# EasyEDA schematic SCH_DV_MR_rev_modbus_18.16_2022-01-16.json

## Sheets
1 DV_MR_rev_18.16_modbus_ADC_555 COILER TIMERS: TITLE: IGNITION CIRCUIT 555; REV: 18.15; Date: 2021-10-15; Sheet: 3/6; Drawn By: David Marshall
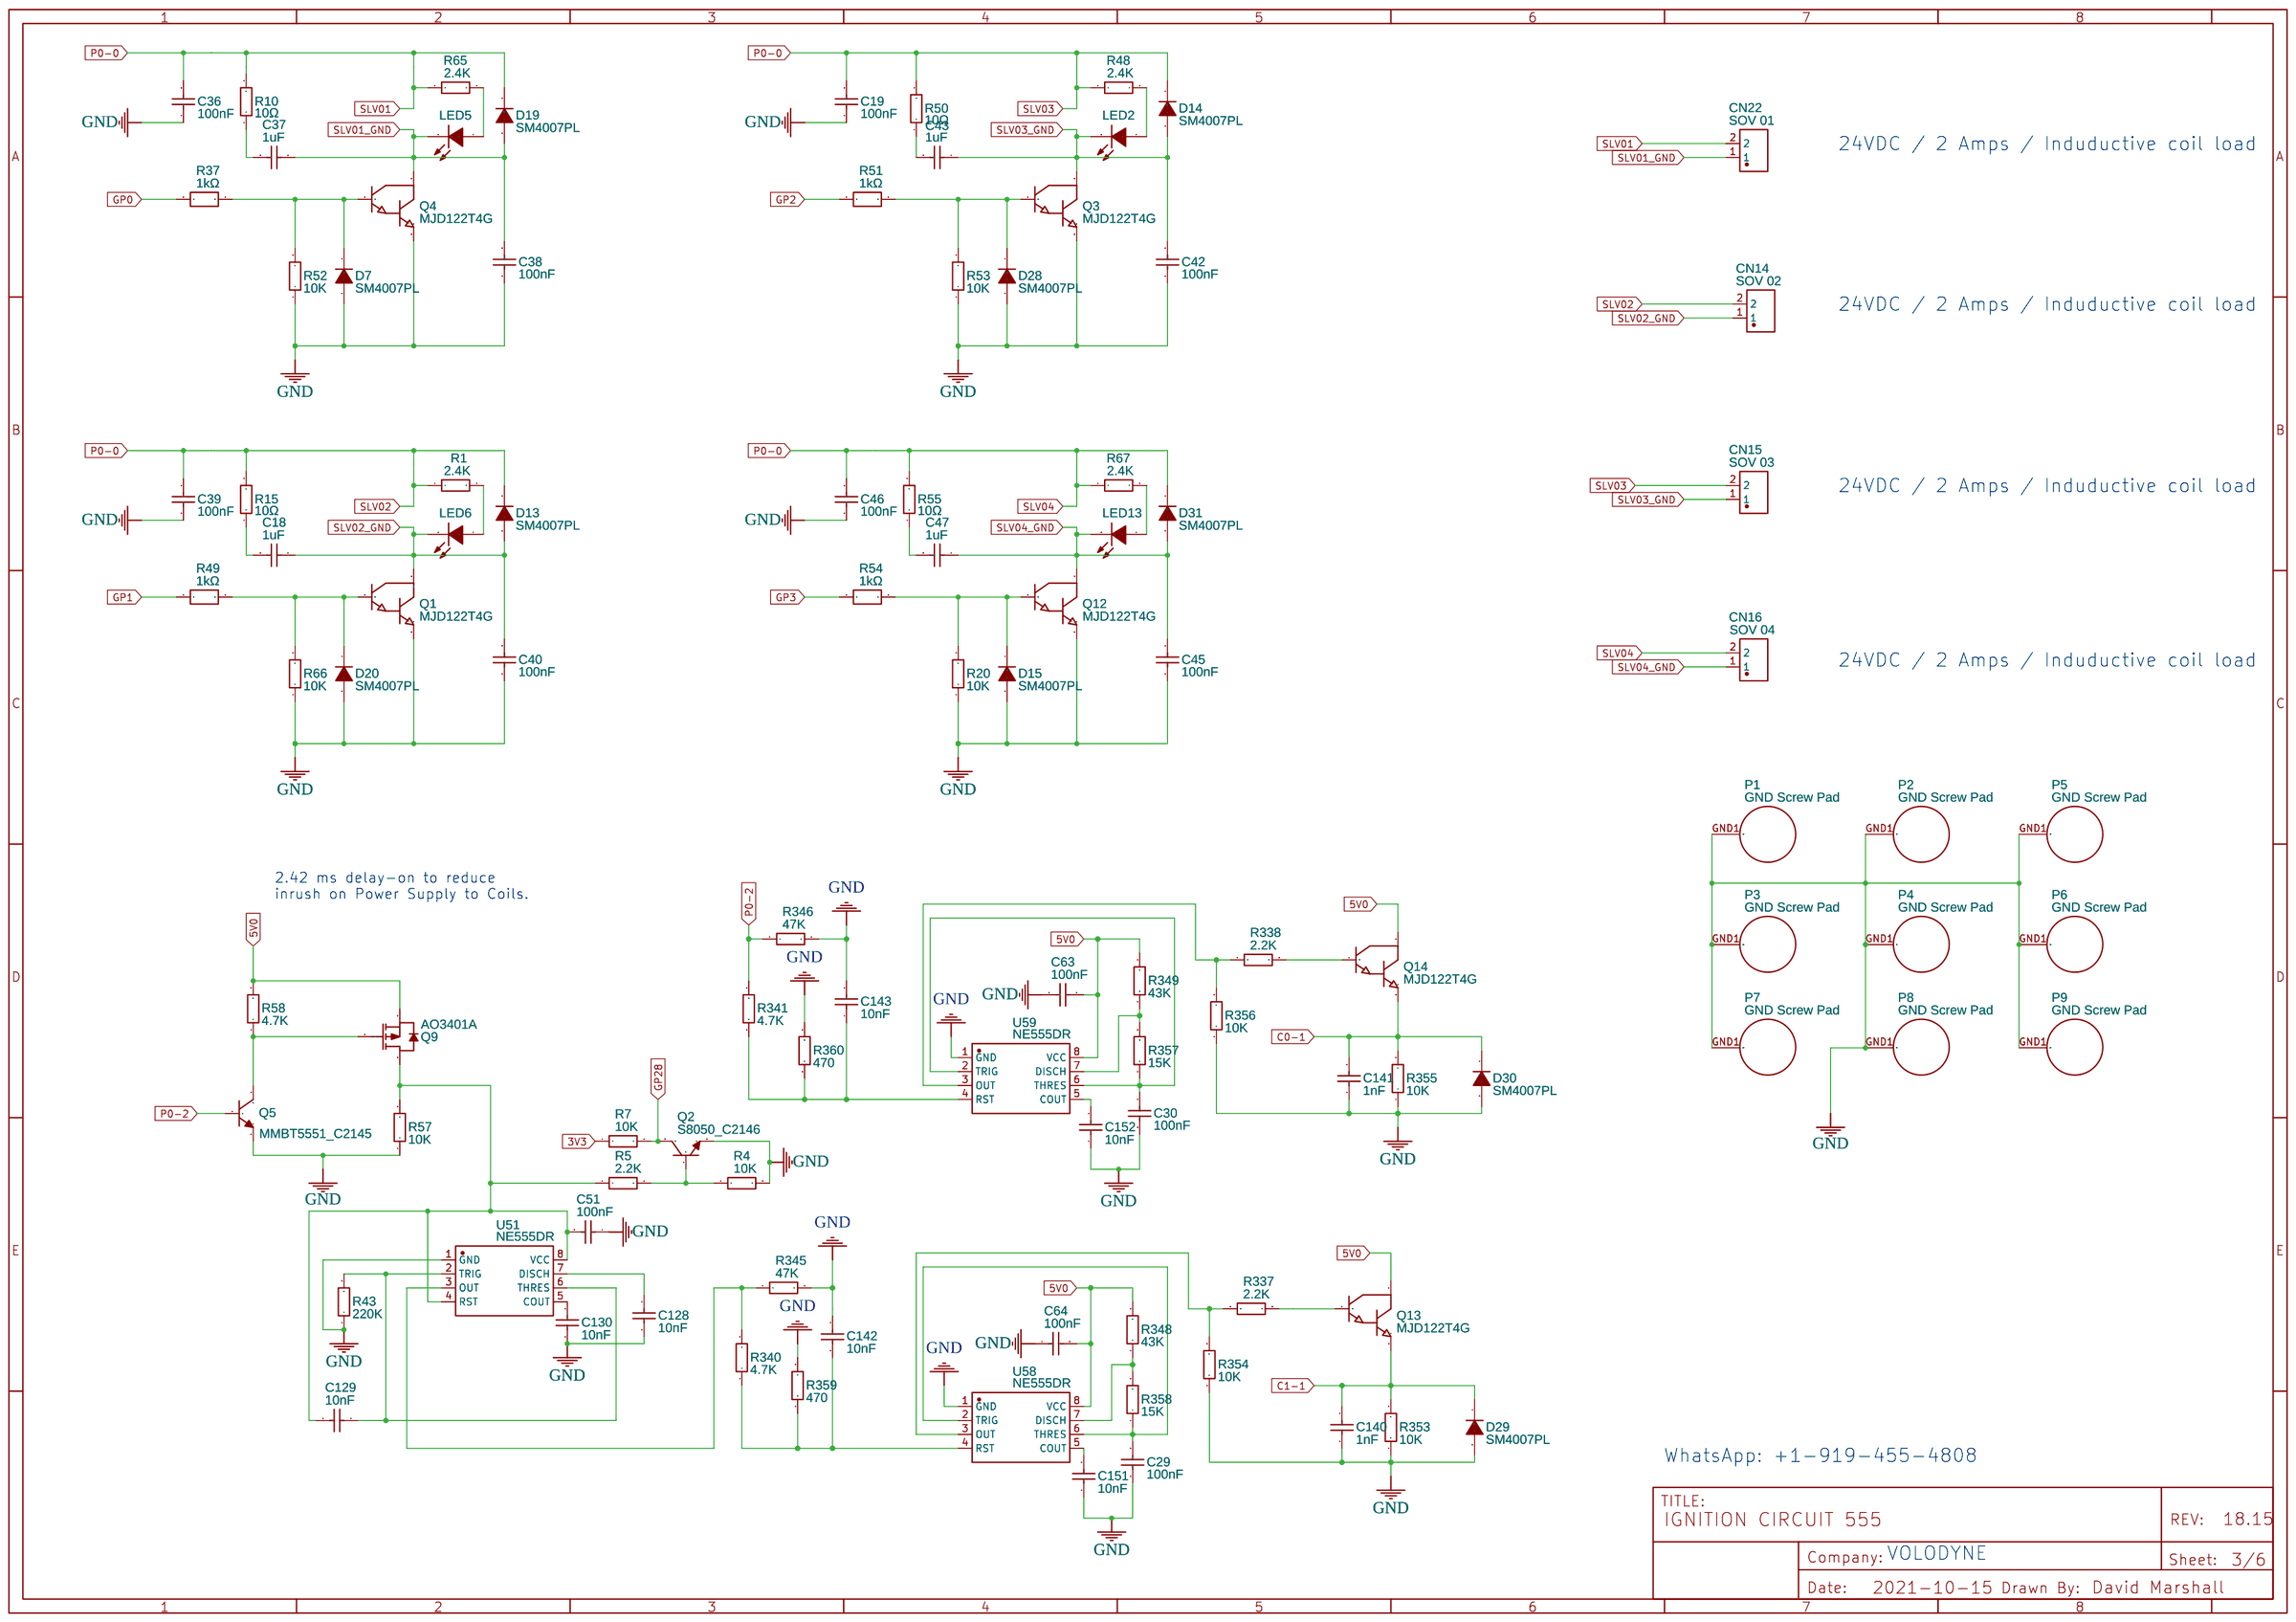
[diagram p0: DV_MR_rev_18.16_modbus_ADC_555 COILER TIMERS]
2 DV_MR_rev_18.16_modbus_ADC_PICO PI MCU: TITLE: MICRO PROCESSOR I2C - MODBUS TCP; Sheet: 5/6
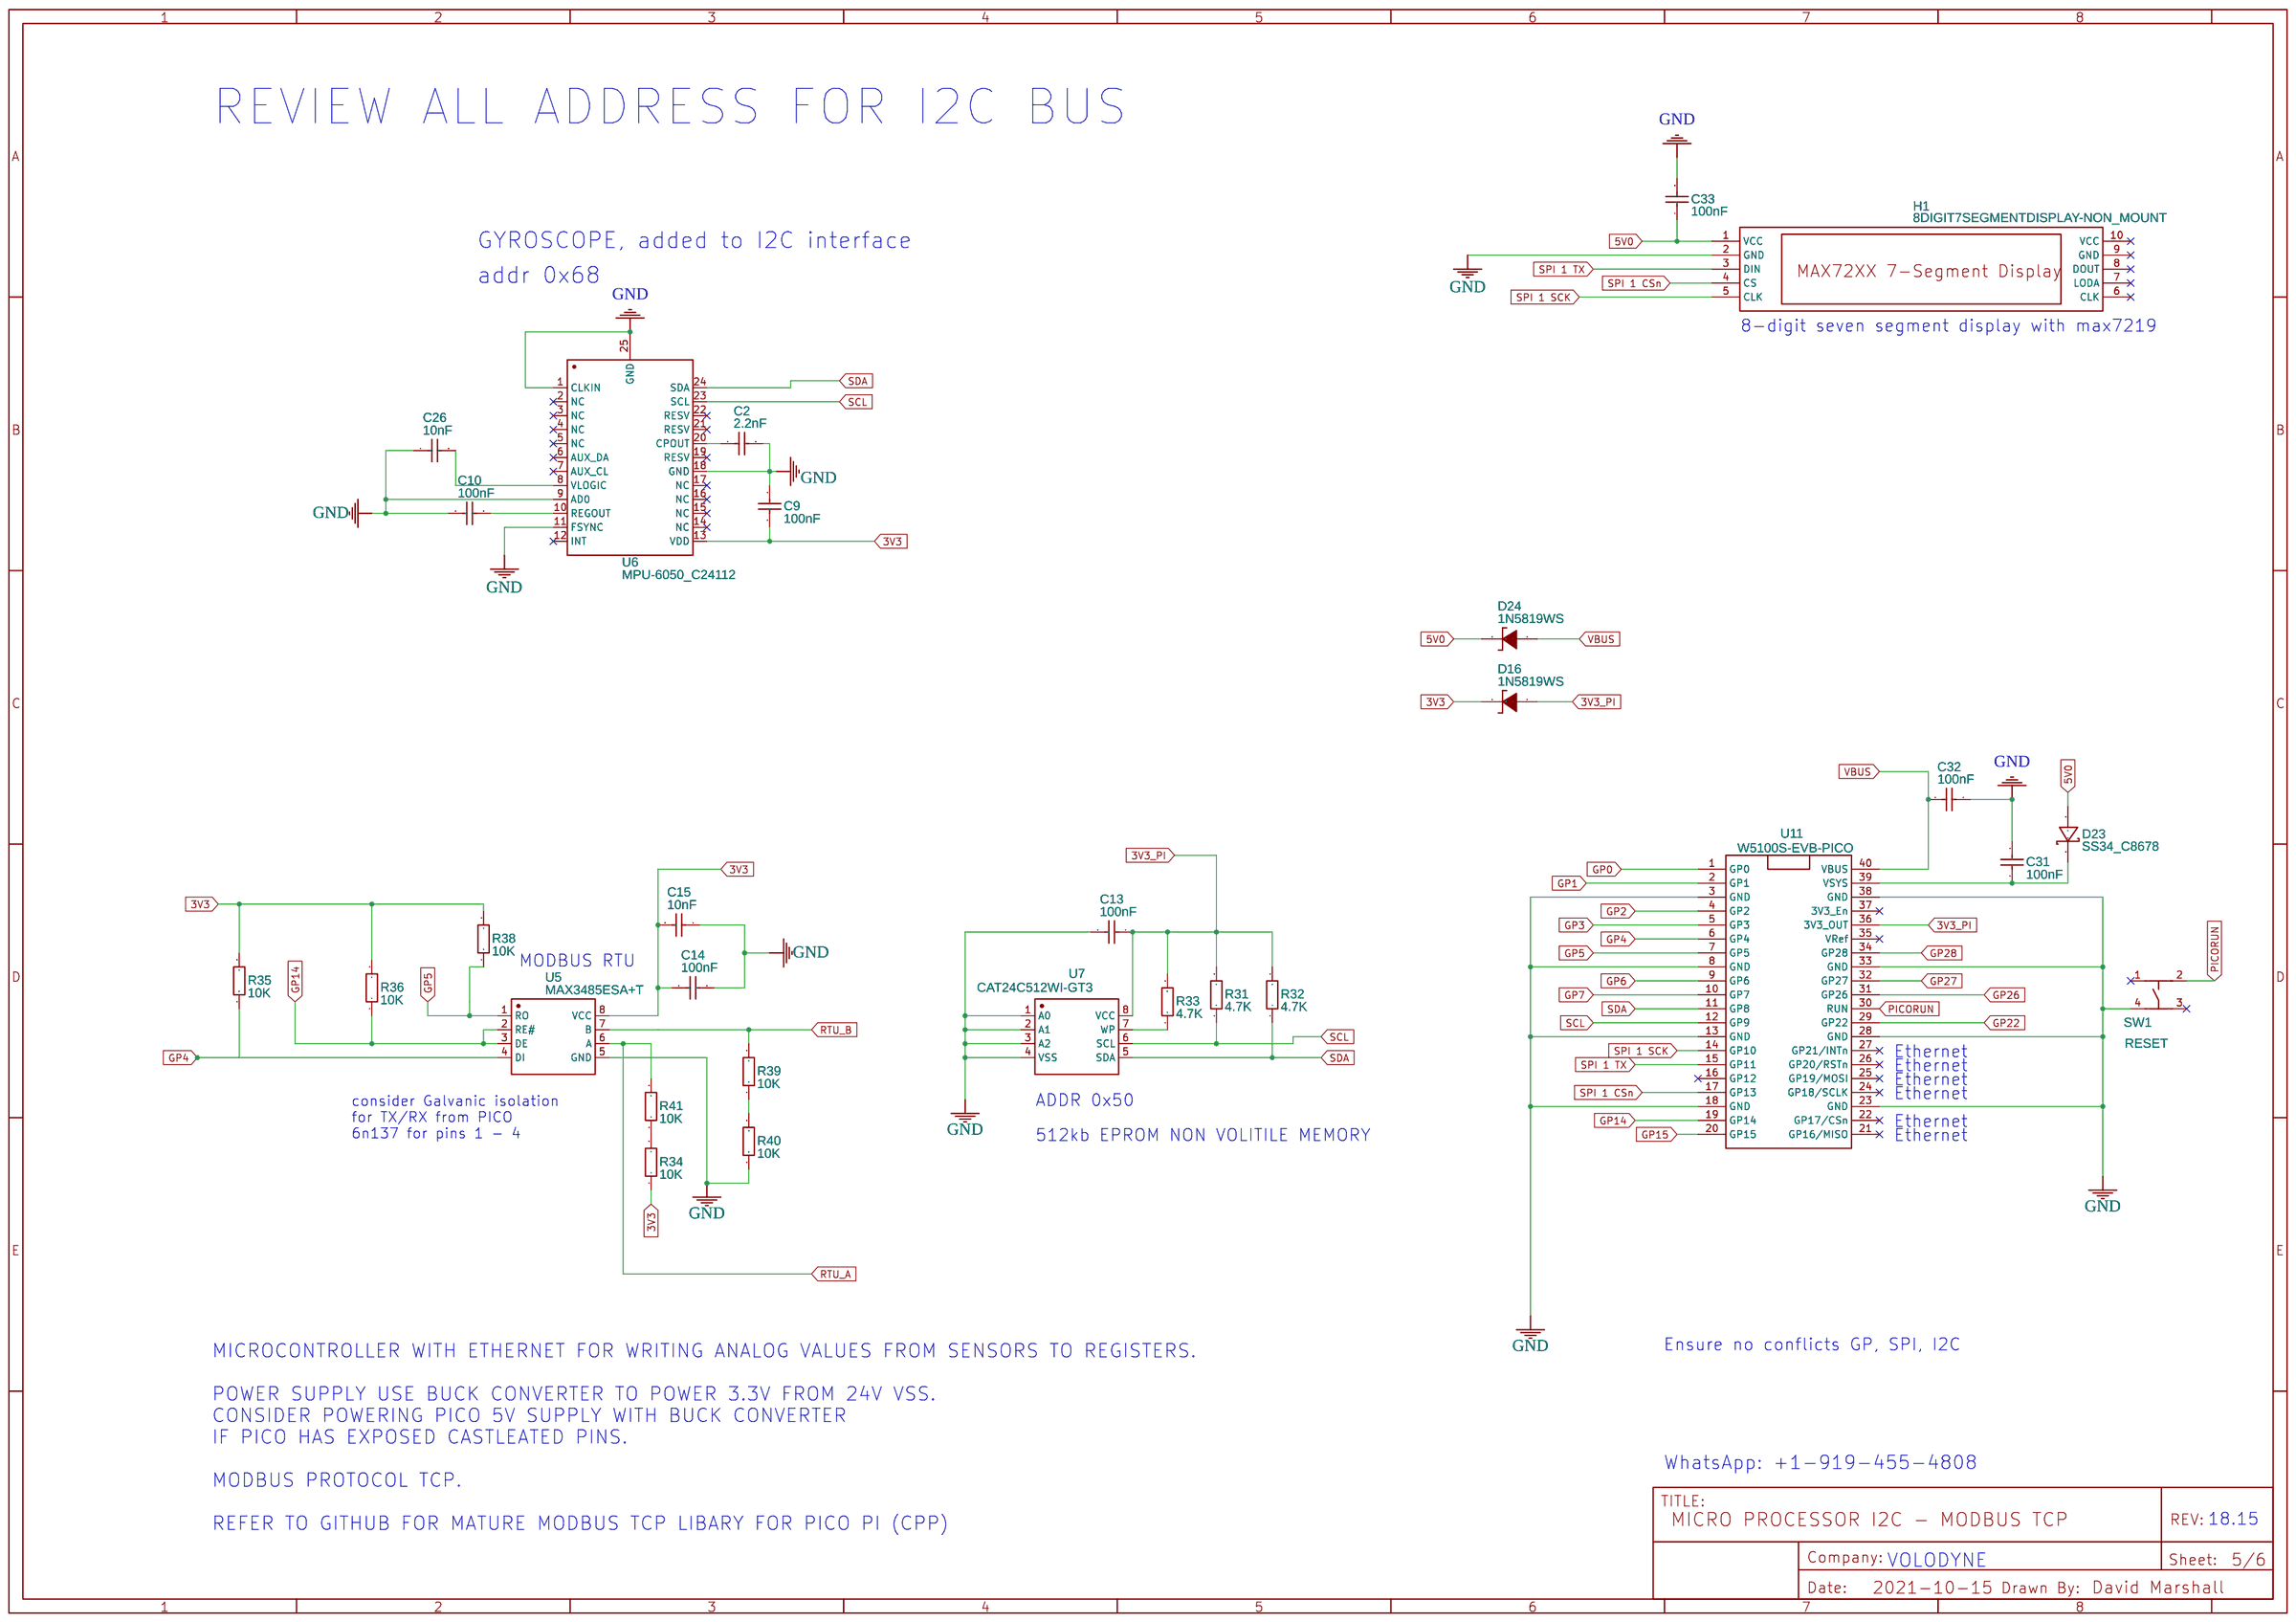
[diagram p1: DV_MR_rev_18.16_modbus_ADC_PICO PI MCU]
3 DV_MR_rev_18.16_modbus_ADC_CURRENT SENSORS: TITLE: CURRENT SENSORS; Sheet: 6/6
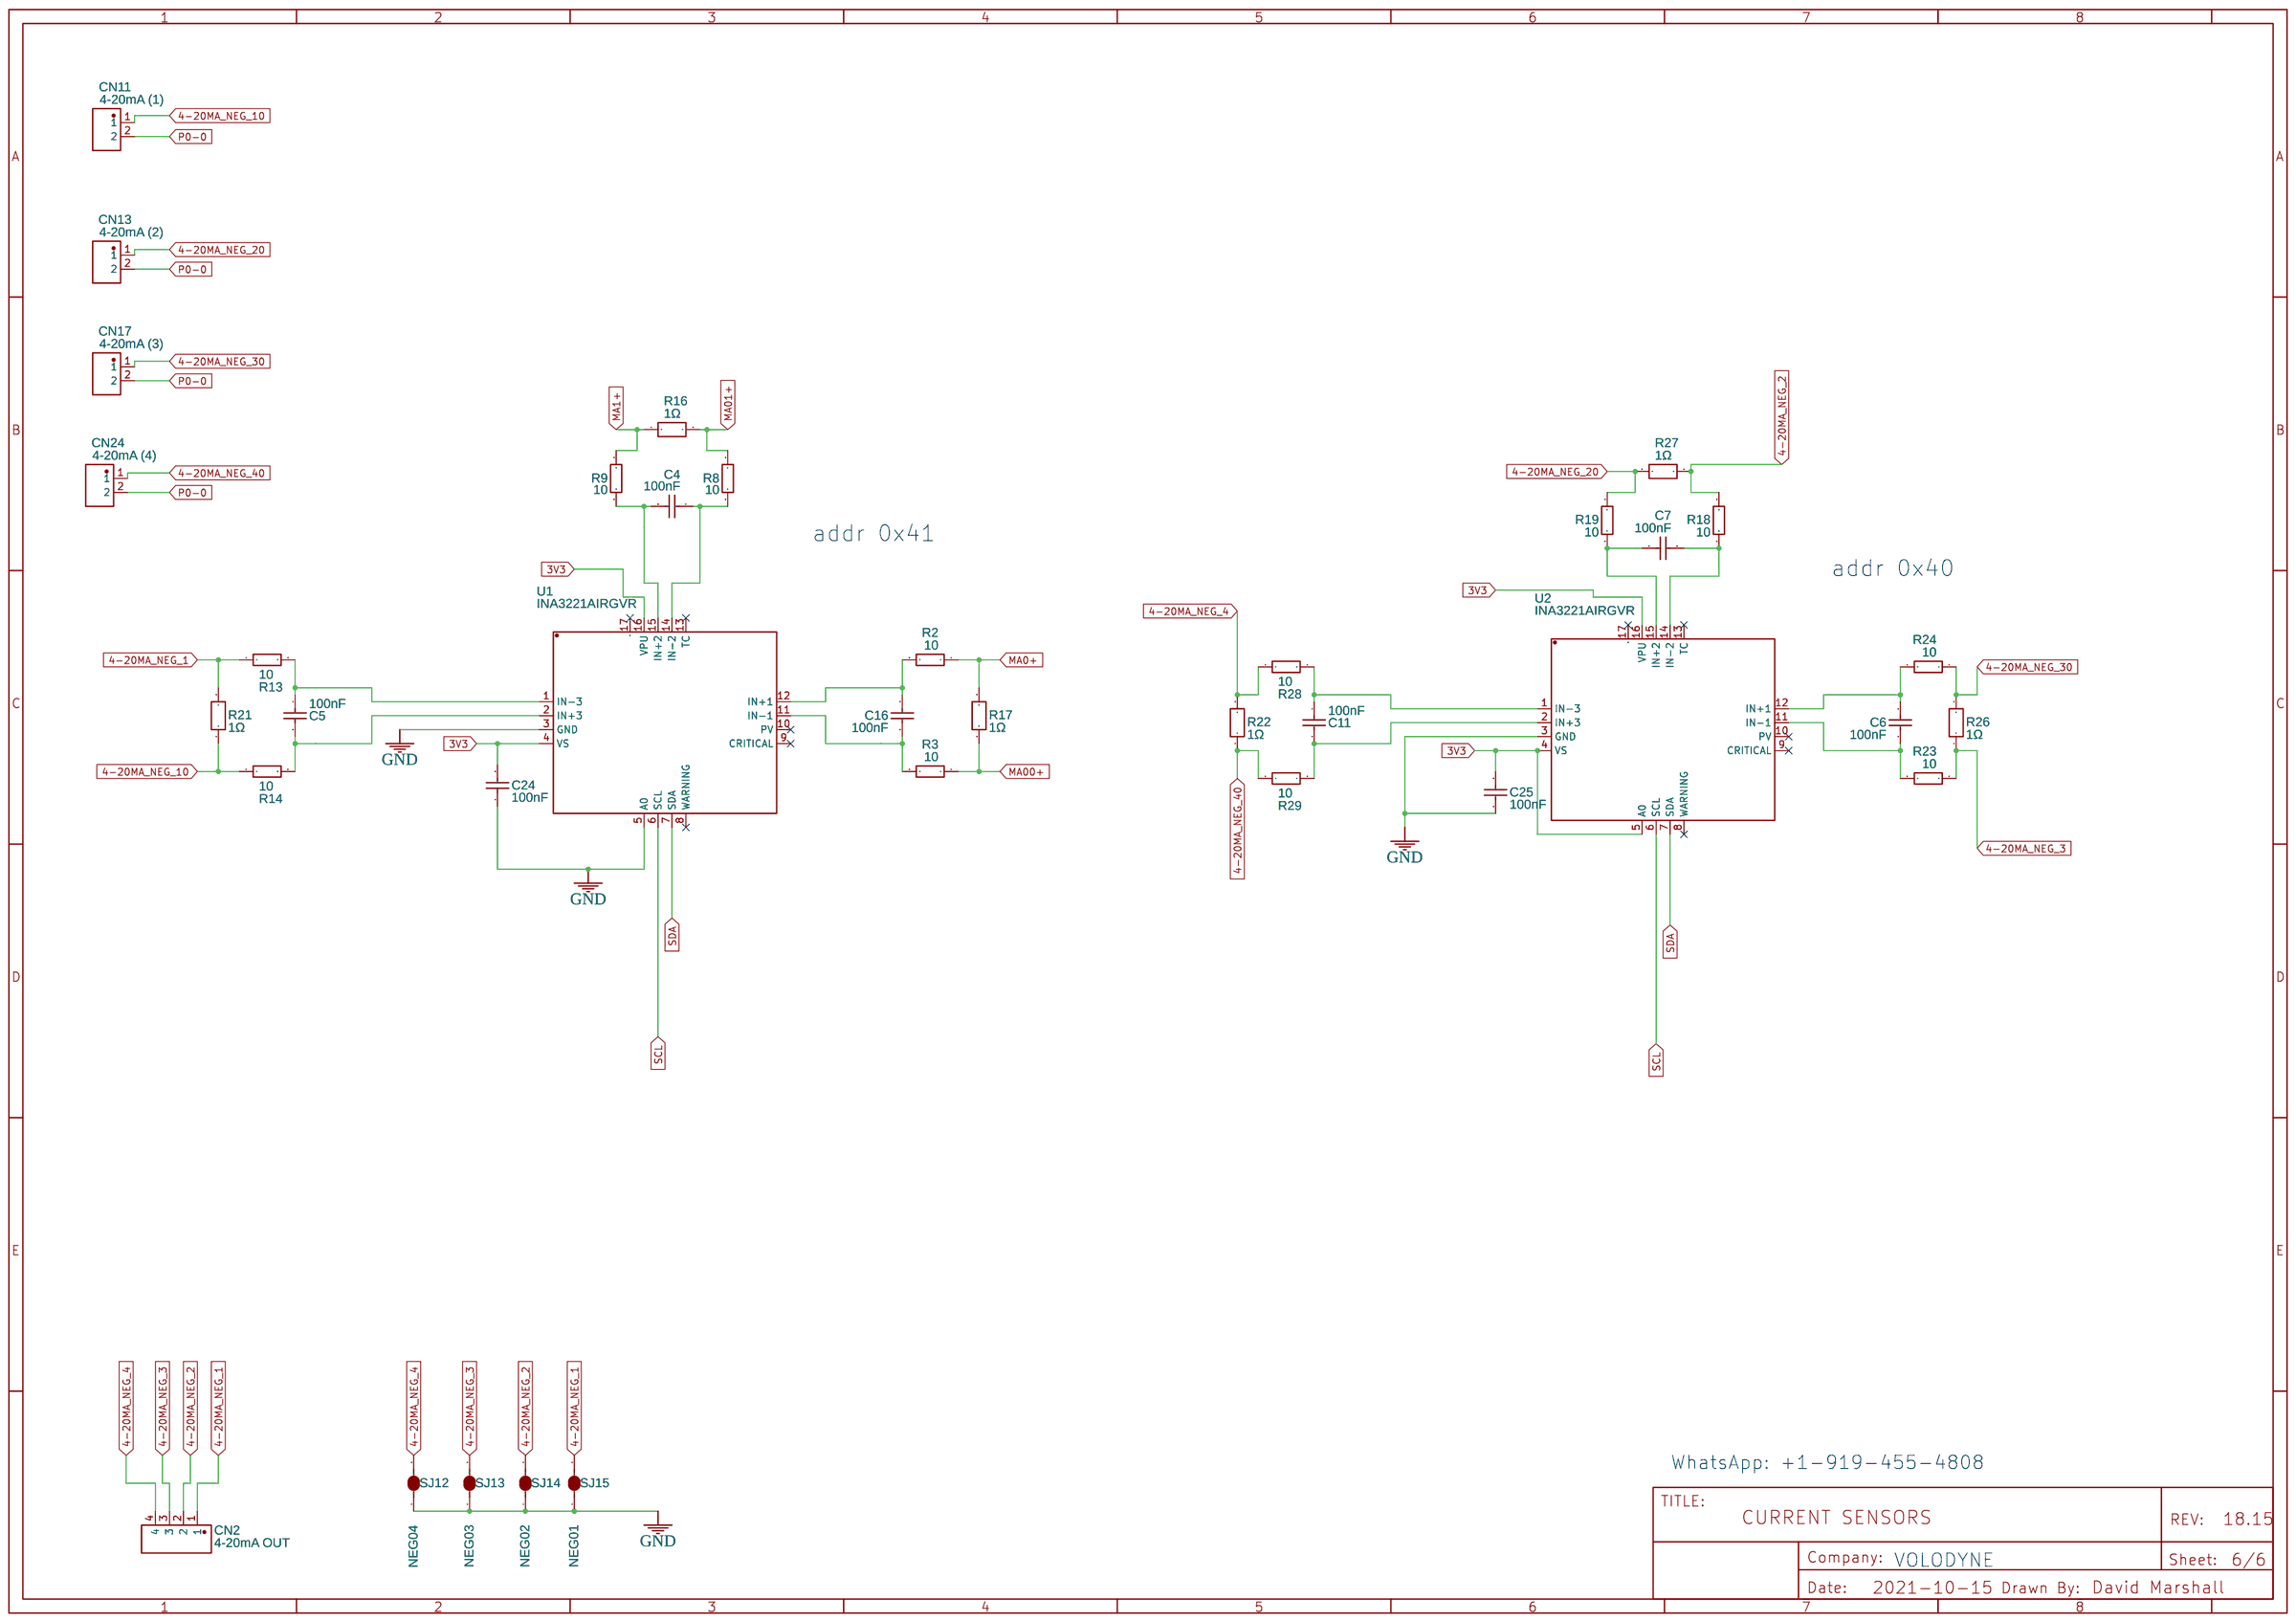
[diagram p2: DV_MR_rev_18.16_modbus_ADC_CURRENT SENSORS]
4 DV_MR_rev_18.16_modbus_ADC_Connectors: TITLE: connectors; Date: 2021-11-04; Sheet: 1/6; Company: VOLODYNE
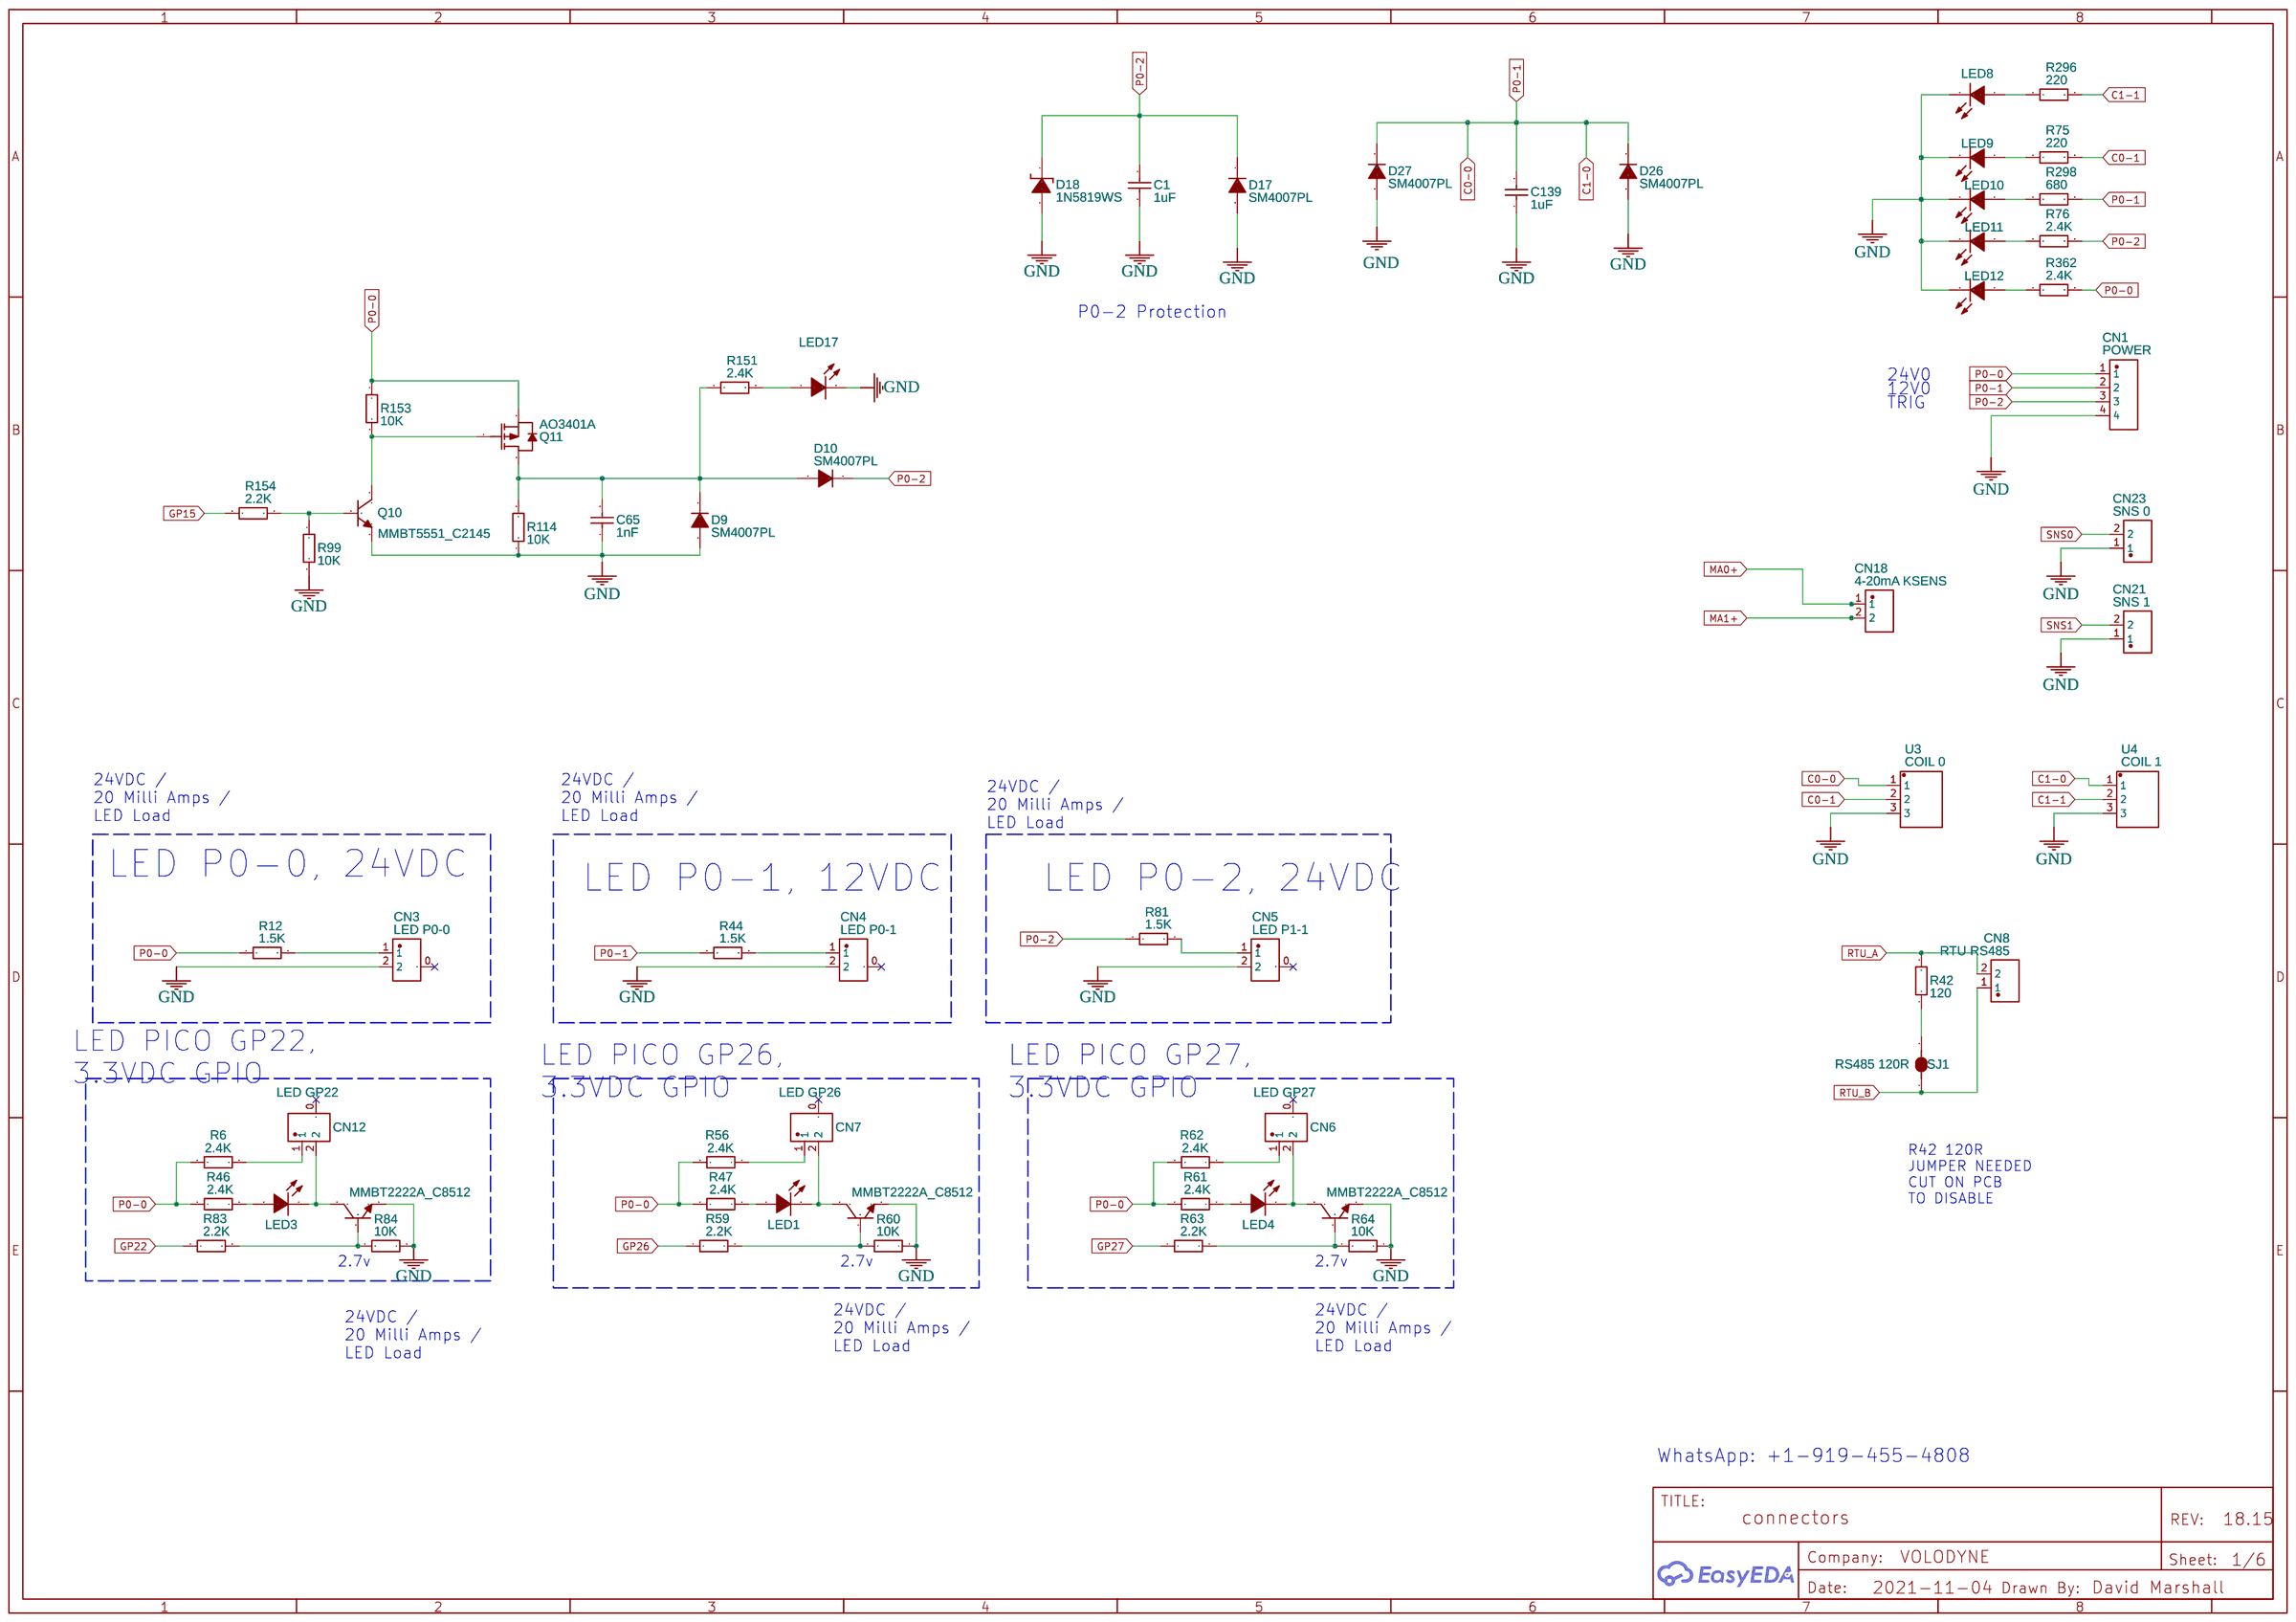
[diagram p3: DV_MR_rev_18.16_modbus_ADC_Connectors]
5 DV_MR_rev_18.16_modbus_ADC_IGN SENSORS: TITLE: KNOCK SENSOR; Date: 2021-11-04; Sheet: 4/6; Company: VOLODYNE
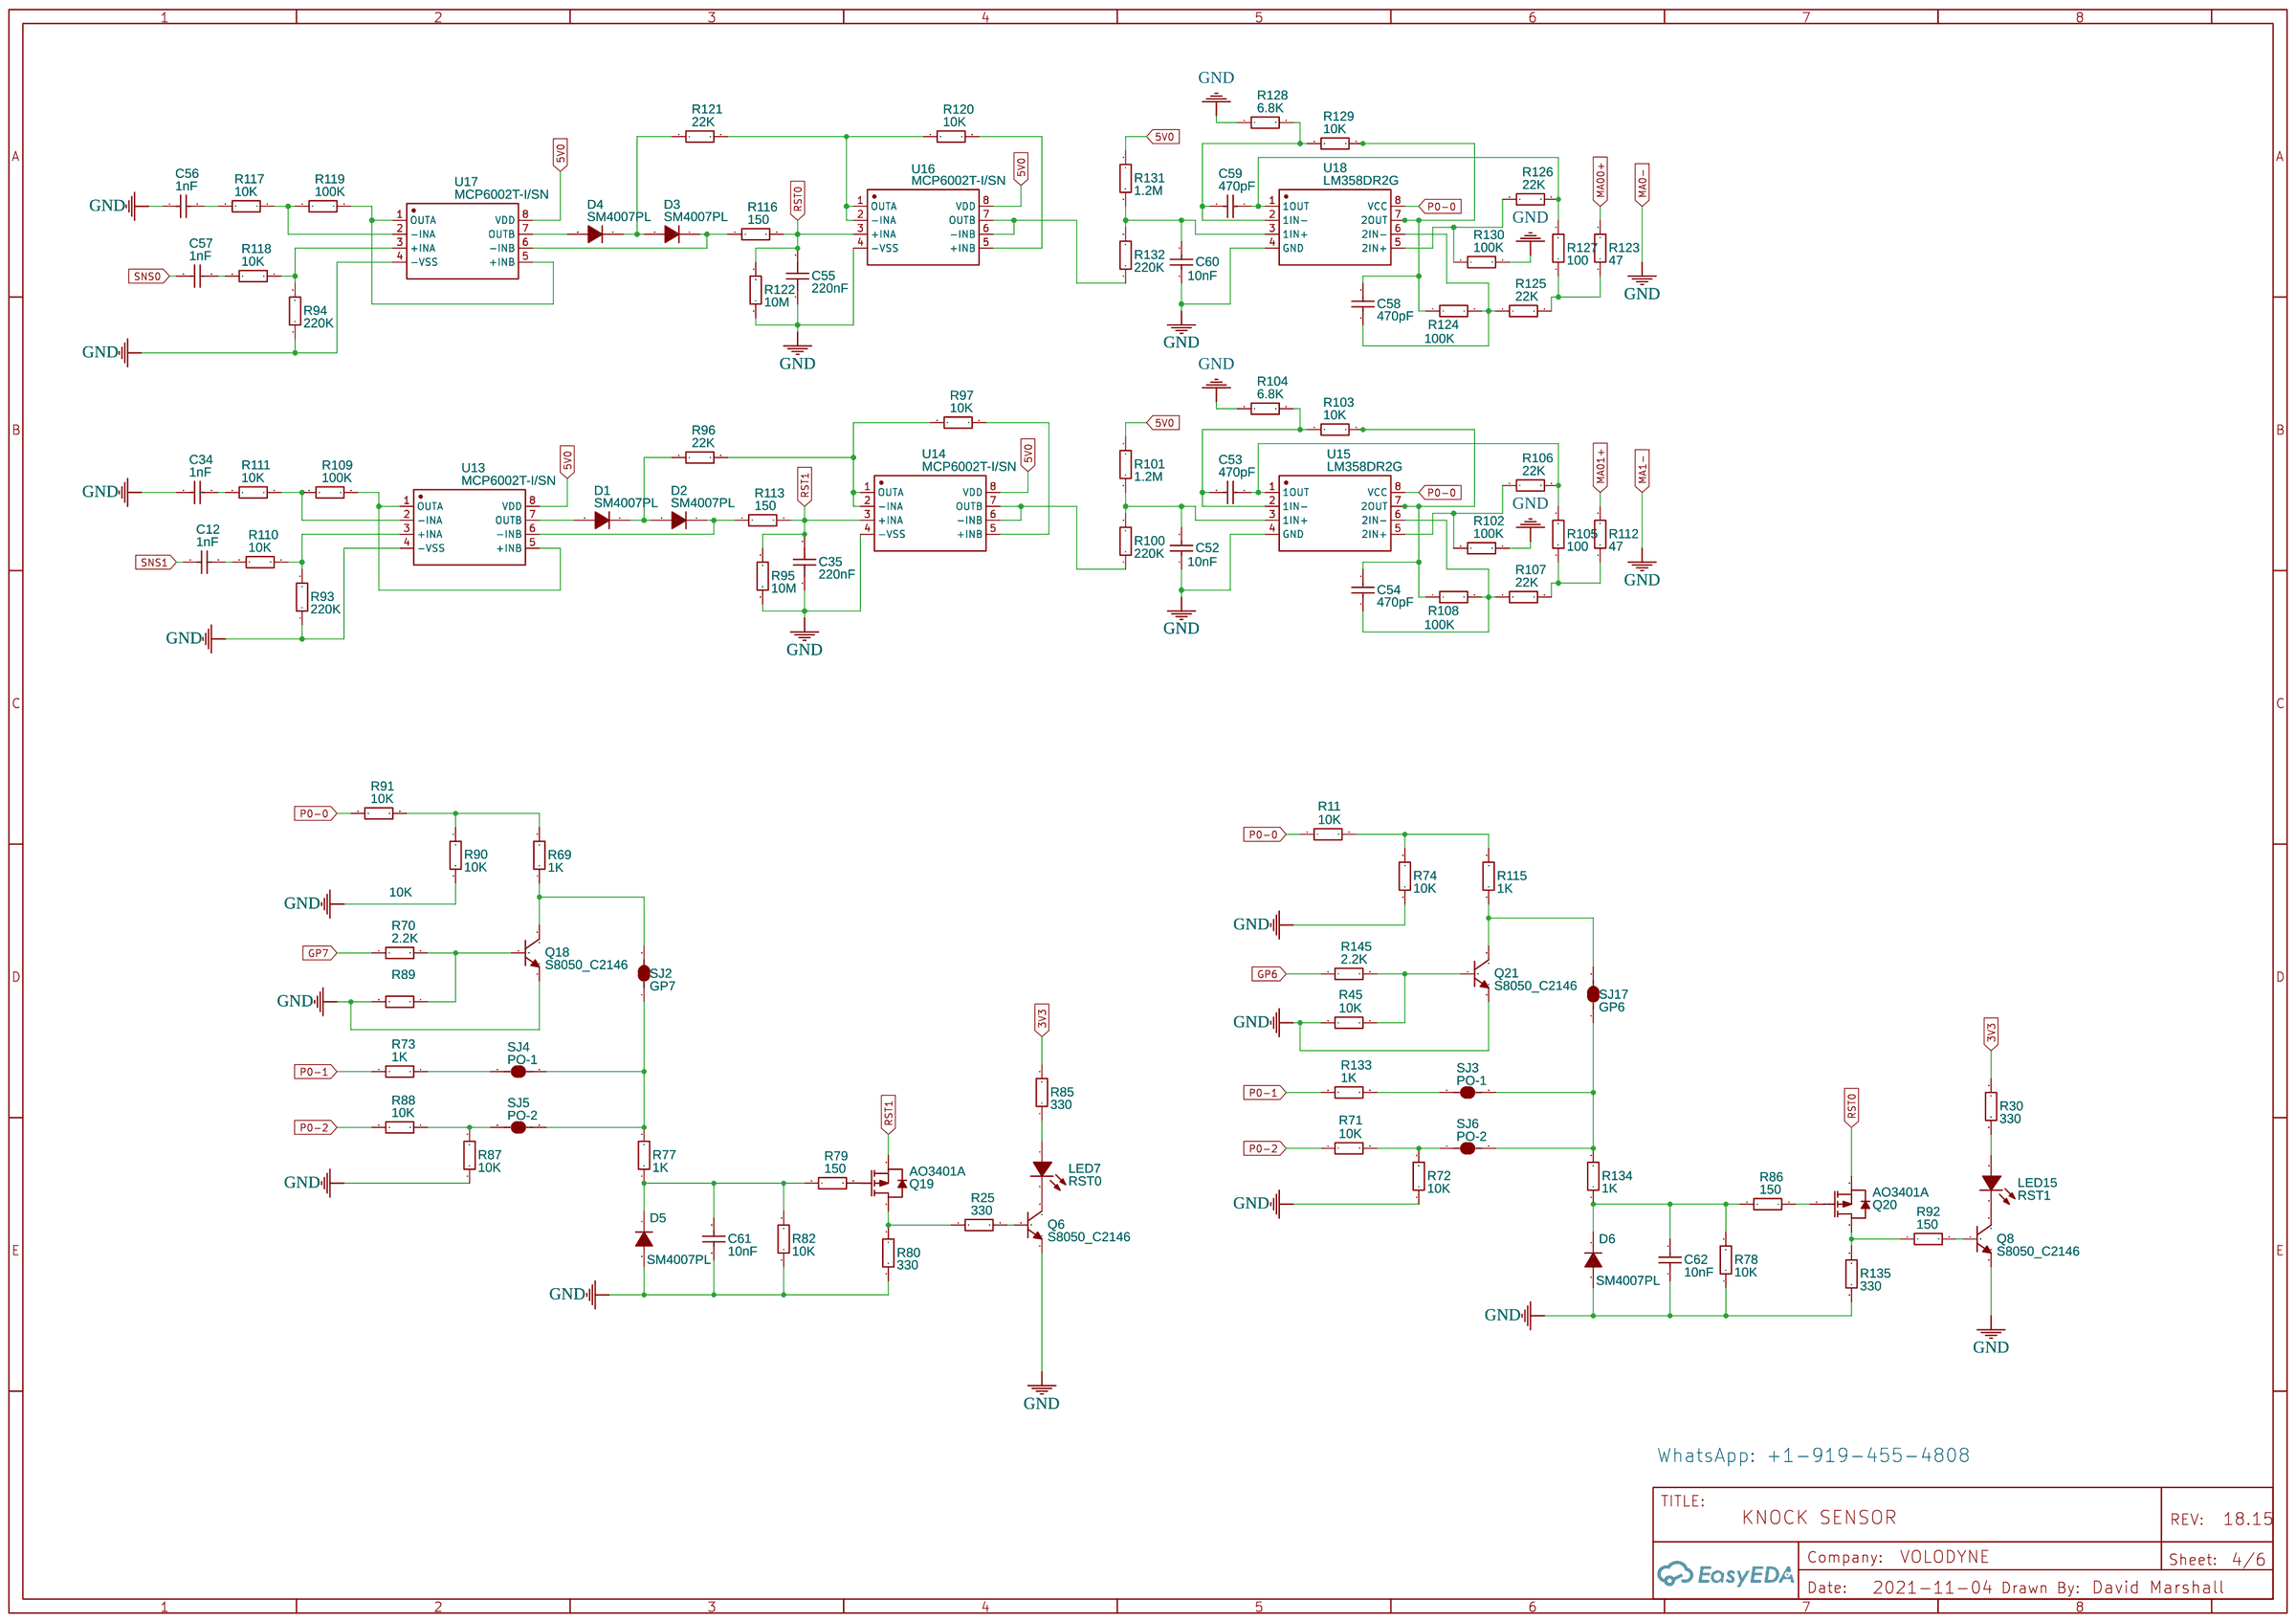
[diagram p4: DV_MR_rev_18.16_modbus_ADC_IGN SENSORS]
6 DV_MR_rev_18.16_modbus_ADC_POWER: TITLE: POWER SUPPLY; Date: 2021-11-04; Sheet: 2/6; Company: VOLODYNE
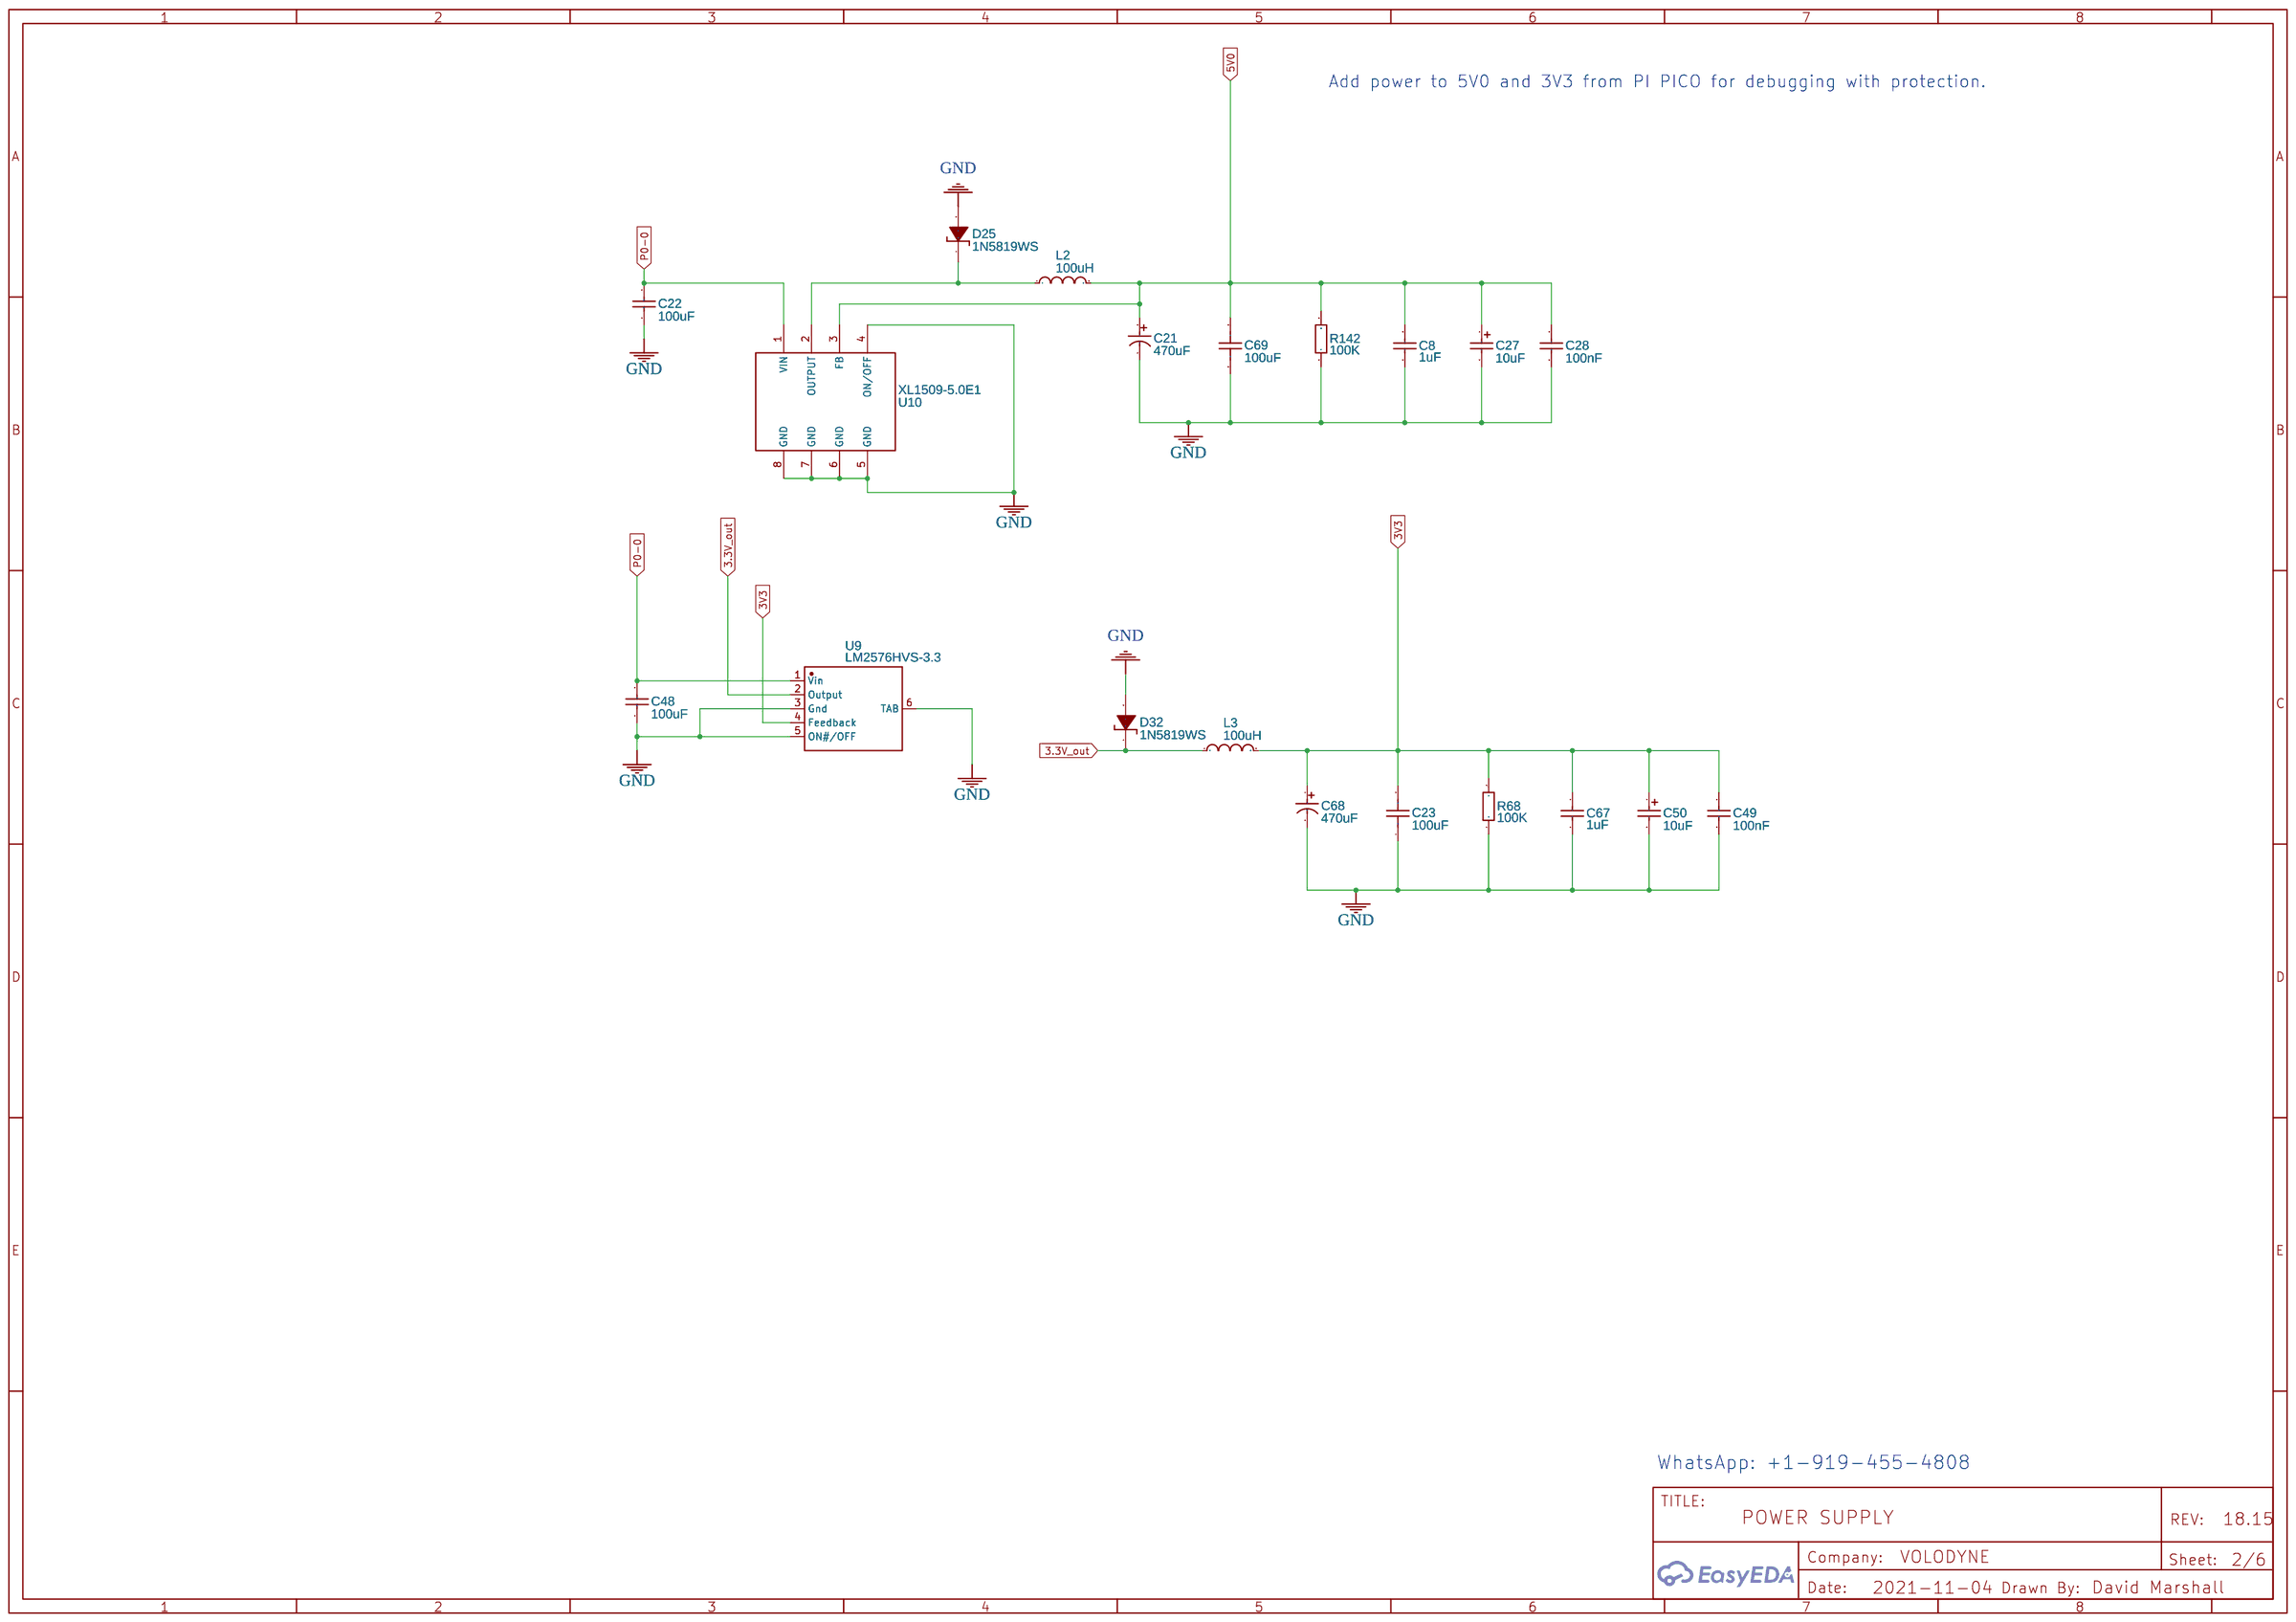
[diagram p5: DV_MR_rev_18.16_modbus_ADC_POWER]

## Parts
sheet DV_MR_rev_18.16_modbus_ADC_555 COILER TIMERS
C18  1uF  [C0603]
C19  100nF  [C0402_NEW]
C29  100nF  [C0402_NEW]
C30  100nF  [C0402_NEW]
C36  100nF  [C0402_NEW]
C37  1uF  [C0603]
C38  100nF  [C0402_NEW]
C39  100nF  [C0402_NEW]
C40  100nF  [C0402_NEW]
C42  100nF  [C0402_NEW]
C43  1uF  [C0603]
C45  100nF  [C0402_NEW]
C46  100nF  [C0402_NEW]
C47  1uF  [C0603]
C51  100nF  [C0402_NEW]
C63  100nF  [C0402_NEW]
C64  100nF  [C0402_NEW]
C128  10nF  [C0603]
C129  10nF  [C0603]
C130  10nF  [C0603]
C140  1nF  [C0402]
C141  1nF  [C0402]
C142  10nF  [C0603]
C143  10nF  [C0603]
C151  10nF  [C0603]
C152  10nF  [C0603]
CN14  SOV 02  [CONN-TH_15EDGVM-3.81-02P-14-00A-H]
CN15  SOV 03  [CONN-TH_15EDGVM-3.81-02P-14-00A-H]
CN16  SOV 04  [CONN-TH_15EDGVM-3.81-02P-14-00A-H]
CN22  SOV 01  [CONN-TH_15EDGVM-3.81-02P-14-00A-H]
D7  SM4007PL  [SOD-123F_L2.8-W1.8-LS3.7-RD]
D13  SM4007PL  [SOD-123F_L2.8-W1.8-LS3.7-RD]
D14  SM4007PL  [SOD-123F_L2.8-W1.8-LS3.7-RD]
D15  SM4007PL  [SOD-123F_L2.8-W1.8-LS3.7-RD]
D19  SM4007PL  [SOD-123F_L2.8-W1.8-LS3.7-RD]
D20  SM4007PL  [SOD-123F_L2.8-W1.8-LS3.7-RD]
D28  SM4007PL  [SOD-123F_L2.8-W1.8-LS3.7-RD]
D29  SM4007PL  [SOD-123F_L2.8-W1.8-LS3.7-RD]
D30  SM4007PL  [SOD-123F_L2.8-W1.8-LS3.7-RD]
D31  SM4007PL  [SOD-123F_L2.8-W1.8-LS3.7-RD]
LED2  SLV03  [LED0603-R-RD]
LED5  SLV01  [LED0603-R-RD]
LED6  SLV02  [LED0603-R-RD]
LED13  SLV04  [LED0603-R-RD]
P1  GND Screw Pad  [GND SCREW PAD]
P2  GND Screw Pad  [GND SCREW PAD]
P3  GND Screw Pad  [GND SCREW PAD]
P4  GND Screw Pad  [GND SCREW PAD]
P5  GND Screw Pad  [GND SCREW PAD]
P6  GND Screw Pad  [GND SCREW PAD]
P7  GND Screw Pad  [GND SCREW PAD]
P8  GND Screw Pad  [GND SCREW PAD]
P9  GND Screw Pad  [GND SCREW PAD]
Q1  MJD122T4G  [TO-252-3_L6.5-W5.8-P4.58-TL]
Q2  S8050_C2146  [SOT-23-3_L3.0-W1.7-P0.95-LS2.9-BR]
Q3  MJD122T4G  [TO-252-3_L6.5-W5.8-P4.58-TL]
Q4  MJD122T4G  [TO-252-3_L6.5-W5.8-P4.58-TL]
Q5  MMBT5551_C2145  [SOT-23-3_L2.9-W1.3-P1.90-LS2.4-BR]
Q9  AO3401A  [SOT-23_L2.9-W1.3-P1.90-LS2.4-BR]
Q12  MJD122T4G  [TO-252-3_L6.5-W5.8-P4.58-TL]
Q13  MJD122T4G  [TO-252-3_L6.5-W5.8-P4.58-TL]
Q14  MJD122T4G  [TO-252-3_L6.5-W5.8-P4.58-TL]
R1  2.4K  [R1206]
R4  10K  [R0603]
R5  2.2K  [R0603]
R7  10K  [R0603]
R10  10Ω  [R0603]
R15  10Ω  [R0603]
R20  10K  [R0603]
R37  1kΩ  [R0603]
R43  220K  [R0603]
R48  2.4K  [R1206]
R49  1kΩ  [R0603]
R50  10Ω  [R0603]
R51  1kΩ  [R0603]
R52  10K  [R0603]
R53  10K  [R0603]
R54  1kΩ  [R0603]
R55  10Ω  [R0603]
R57  10K  [R0603]
R58  4.7K  [R1206]
R65  2.4K  [R1206]
R66  10K  [R0603]
R67  2.4K  [R1206]
R337  2.2K  [R0603]
R338  2.2K  [R0603]
R340  4.7K  [R1206]
R341  4.7K  [R1206]
R345  47K  [R0805]
R346  47K  [R0805]
R348  43K  [R0603]
R349  43K  [R0603]
R353  10K  [R0603]
R354  10K  [R0603]
R355  10K  [R0603]
R356  10K  [R0603]
R357  15K  [R0603]
R358  15K  [R0603]
R359  470  [R0805]
R360  470  [R0805]
U51  NE555DR  [SOIC-8_L4.9-W3.9-P1.27-LS6.0-BL]
U58  NE555DR  [SOIC-8_L4.9-W3.9-P1.27-LS6.0-BL]
U59  NE555DR  [SOIC-8_L4.9-W3.9-P1.27-LS6.0-BL]
sheet DV_MR_rev_18.16_modbus_ADC_Connectors
C1  1uF  [C0603]
C65  1nF  [C0402]
C139  1uF  [C0603]
CN1  POWER  [CONN-TH_4P-P3.81_WJ15EDGVM-3.81-04P-14-00A]
CN3  LED P0-0  [CONN-SMD_A2008WV-S-2P]
CN4  LED P0-1  [CONN-SMD_A2008WV-S-2P]
CN5  LED P1-1  [CONN-SMD_A2008WV-S-2P]
CN6  LED GP27  [CONN-SMD_A2008WV-S-2P]
CN7  LED GP26  [CONN-SMD_A2008WV-S-2P]
CN8  RTU RS485  [CONN-TH_15EDGVM-3.81-02P-14-00A-H]
CN12  LED GP22  [CONN-SMD_A2008WV-S-2P]
CN18  4-20mA KSENS  [CONN-TH_15EDGVM-3.81-02P-14-00A-H]
CN21  SNS 1  [CONN-TH_15EDGVM-3.81-02P-14-00A-H]
CN23  SNS 0  [CONN-TH_15EDGVM-3.81-02P-14-00A-H]
D9  SM4007PL  [SOD-123F_L2.8-W1.8-LS3.7-RD]
D10  SM4007PL  [SOD-123F_L2.8-W1.8-LS3.7-RD]
D17  SM4007PL  [SOD-123F_L2.8-W1.8-LS3.7-RD]
D18  1N5819WS  [SOD-323_L1.8-W1.3-LS2.5-RD]
D26  SM4007PL  [SOD-123F_L2.8-W1.8-LS3.7-RD]
D27  SM4007PL  [SOD-123F_L2.8-W1.8-LS3.7-RD]
LED1  LED GP26  [LED0603-R-RD]
LED3  LED GP22  [LED0603-R-RD]
LED4  LED GP27  [LED0603-R-RD]
LED8  C1-1  [LED0805-FD]
LED9  C0-1  [LED0805-FD]
LED10  P0-1  [LED0805-FD]
LED11  P1-1  [LED0805-FD]
LED12  P0-0  [LED0805-FD]
LED17  GP15 TRIG  [LED0603-R-RD_WHITE]
Q10  MMBT5551_C2145  [SOT-23-3_L2.9-W1.3-P1.90-LS2.4-BR]
Q11  AO3401A  [SOT-23_L2.9-W1.3-P1.90-LS2.4-BR]
Q15  MMBT2222A_C8512  [SOT-23-3_L2.9-W1.3-P1.90-LS2.4-BR]
Q17  MMBT2222A_C8512  [SOT-23-3_L2.9-W1.3-P1.90-LS2.4-BR]
Q22  MMBT2222A_C8512  [SOT-23-3_L2.9-W1.3-P1.90-LS2.4-BR]
R6  2.4K  [R1206]
R12  1.5K  [R0603]
R42  120  [R0603]
R44  1.5K  [R0603]
R46  2.4K  [R1206]
R47  2.4K  [R1206]
R56  2.4K  [R1206]
R59  2.2K  [R0603]
R60  10K  [R0603]
R61  2.4K  [R1206]
R62  2.4K  [R1206]
R63  2.2K  [R0603]
R64  10K  [R0603]
R75  220  [R0402]
R76  2.4K  [R1206]
R81  1.5K  [R0603]
R83  2.2K  [R0603]
R84  10K  [R0603]
R99  10K  [R0603]
R114  10K  [R0603]
R151  2.4K  [R1206]
R153  10K  [R0603]
R154  2.2K  [R0603]
R296  220  [R0402]
R298  680  [R0402]
R362  2.4K  [R1206]
SJ1  RS485 120R  [PAD-JUMPER-2-NO_YES_SILK]
U3  COIL 0  [CONN-TH_3P-P3.81_WJ15EDGVM-3.81-3P]
U4  COIL 1  [CONN-TH_3P-P3.81_WJ15EDGVM-3.81-3P]
sheet DV_MR_rev_18.16_modbus_ADC_CURRENT SENSORS
C4  100nF  [C0402_NEW]
C5  100nF  [C0402_NEW]
C6  100nF  [C0402_NEW]
C7  100nF  [C0402_NEW]
C11  100nF  [C0402_NEW]
C16  100nF  [C0402_NEW]
C24  100nF  [C0402_NEW]
C25  100nF  [C0402_NEW]
CN2  4-20mA OUT  [CONN-TH_4P-P3.81_WJ15EDGVM-3.81-04P-14-00A]
CN11  4-20mA (1)  [CONN-TH_15EDGVM-3.81-02P-14-00A-H]
CN13  4-20mA (2)  [CONN-TH_15EDGVM-3.81-02P-14-00A-H]
CN17  4-20mA (3)  [CONN-TH_15EDGVM-3.81-02P-14-00A-H]
CN24  4-20mA (4)  [CONN-TH_15EDGVM-3.81-02P-14-00A-H]
R2  10  [R0402]
R3  10  [R0402]
R8  10  [R0402]
R9  10  [R0402]
R13  10  [R0402]
R14  10  [R0402]
R16  1Ω  [R1206]
R17  1Ω  [R1206]
R18  10  [R0402]
R19  10  [R0402]
R21  1Ω  [R1206]
R22  1Ω  [R1206]
R23  10  [R0402]
R24  10  [R0402]
R26  1Ω  [R1206]
R27  1Ω  [R1206]
R28  10  [R0402]
R29  10  [R0402]
SJ12  NEG04  [PAD-JUMPER-2-NO_YES_SILK]
SJ13  NEG03  [PAD-JUMPER-2-NO_YES_SILK]
SJ14  NEG02  [PAD-JUMPER-2-NO_YES_SILK]
SJ15  NEG01  [PAD-JUMPER-2-NO_YES_SILK]
U1  INA3221AIRGVR  [QFN-16_L4.0-W4.0-P0.65-TL-EP2.2]
U2  INA3221AIRGVR  [QFN-16_L4.0-W4.0-P0.65-TL-EP2.2]
sheet DV_MR_rev_18.16_modbus_ADC_IGN SENSORS
C12  1nF  [C0402]
C34  1nF  [C0402]
C35  220nF  [CAP-TH_L7.2-W3.5-P5.00-D0.5]
C52  10nF  [C0603]
C53  470pF  [C0603]
C54  470pF  [C0603]
C55  220nF  [CAP-TH_L7.2-W3.5-P5.00-D0.5]
C56  1nF  [C0402]
C57  1nF  [C0402]
C58  470pF  [C0603]
C59  470pF  [C0603]
C60  10nF  [C0603]
C61  10nF  [C0603]
C62  10nF  [C0603]
D1  SM4007PL  [SOD-123F_L2.8-W1.8-LS3.7-RD]
D2  SM4007PL  [SOD-123F_L2.8-W1.8-LS3.7-RD]
D3  SM4007PL  [SOD-123F_L2.8-W1.8-LS3.7-RD]
D4  SM4007PL  [SOD-123F_L2.8-W1.8-LS3.7-RD]
D5  SM4007PL  [SOD-123F_L2.8-W1.8-LS3.7-RD]
D6  SM4007PL  [SOD-123F_L2.8-W1.8-LS3.7-RD]
LED7  RST0  [LED0603-R-RD_WHITE]
LED15  RST1  [LED0603-R-RD_WHITE]
Q6  S8050_C2146  [SOT-23-3_L3.0-W1.7-P0.95-LS2.9-BR]
Q8  S8050_C2146  [SOT-23-3_L3.0-W1.7-P0.95-LS2.9-BR]
Q18  S8050_C2146  [SOT-23-3_L3.0-W1.7-P0.95-LS2.9-BR]
Q19  AO3401A  [SOT-23_L2.9-W1.3-P0.95-LS2.4-BR]
Q20  AO3401A  [SOT-23_L2.9-W1.3-P0.95-LS2.4-BR]
Q21  S8050_C2146  [SOT-23-3_L3.0-W1.7-P0.95-LS2.9-BR]
R11  10K  [R0402]
R25  330  [R0402]
R30  330  [R0402]
R45  10K  [R0402]
R69  1K  [R0402]
R70  2.2K  [R0603]
R71  10K  [R0402]
R72  10K  [R0402]
R73  1K  [R0402]
R74  10K  [R0402]
R77  1K  [R0402]
R78  10K  [R0402]
R79  150  [R0402]
R80  330  [R0603]
R82  10K  [R0402]
R85  330  [R0402]
R86  150  [R0402]
R87  10K  [R0402]
R88  10K  [R0402]
R89  10K  [R0402]
R90  10K  [R0402]
R91  10K  [R0402]
R92  150  [R0402]
R93  220K  [R0603]
R94  220K  [R0603]
R95  10M  [R0603]
R96  22K  [R0402]
R97  10K  [R0402]
R100  220K  [R0603]
R101  1.2M  [R0805]
R102  100K  [R0603]
R103  10K  [R0402]
R104  6.8K  [R0603]
R105  100  [R0603]
R106  22K  [R0402]
R107  22K  [R0402]
R108  100K  [R0603]
R109  100K  [R0603]
R110  10K  [R0603]
R111  10K  [R0603]
R112  47  [R0603]
R113  150  [R0805]
R115  1K  [R0402]
R116  150  [R0805]
R117  10K  [R0603]
R118  10K  [R0603]
R119  100K  [R0603]
R120  10K  [R0402]
R121  22K  [R0402]
R122  10M  [R0603]
R123  47  [R0603]
R124  100K  [R0603]
R125  22K  [R0402]
R126  22K  [R0402]
R127  100  [R0603]
R128  6.8K  [R0603]
R129  10K  [R0402]
R130  100K  [R0603]
R131  1.2M  [R0805]
R132  220K  [R0603]
R133  1K  [R0402]
R134  1K  [R0402]
R135  330  [R0402]
R145  2.2K  [R0603]
SJ2  GP7  [PAD-JUMPER-2-NC_BY_TRACE_YES_SILK]
SJ3  PO-1  [PAD-JUMPER-2-NO_YES_SILK]
SJ4  PO-1  [PAD-JUMPER-2-NO_YES_SILK]
SJ5  PO-2  [PAD-JUMPER-2-NO_YES_SILK]
SJ6  PO-2  [PAD-JUMPER-2-NO_YES_SILK]
SJ17  GP6  [PAD-JUMPER-2-NC_BY_TRACE_YES_SILK]
U13  MCP6002T-I/SN  [SOIC-8_L4.9-W3.9-P1.27-LS6.0-BL]
U14  MCP6002T-I/SN  [SOIC-8_L4.9-W3.9-P1.27-LS6.0-BL]
U15  LM358DR2G  [SOIC-8_L5.0-W4.0-P1.27-LS6.0-BL]
U16  MCP6002T-I/SN  [SOIC-8_L4.9-W3.9-P1.27-LS6.0-BL]
U17  MCP6002T-I/SN  [SOIC-8_L4.9-W3.9-P1.27-LS6.0-BL]
U18  LM358DR2G  [SOIC-8_L5.0-W4.0-P1.27-LS6.0-BL]
sheet DV_MR_rev_18.16_modbus_ADC_PICO PI MCU
C2  2.2nF  [C0402]
C9  100nF  [C0402_NEW]
C10  100nF  [C0402_NEW]
C13  100nF  [C0402_NEW]
C14  100nF  [C0402_NEW]
C15  10nF  [C0603]
C26  10nF  [C0603]
C31  100nF  [C0402_NEW]
C32  100nF  [C0402_NEW]
C33  100nF  [C0402_NEW]
D16  1N5819WS  [SOD-323_L1.8-W1.3-LS2.5-RD]
D23  SS34_C8678  [DO-214AC_L4.3-W2.7-LS5.3-RD]
D24  1N5819WS  [SOD-323_L1.8-W1.3-LS2.5-RD]
H1  8DIGIT7SEGMENTDISPLAY-NON_MOUNT  [8DIGIT7SEGMENTDISPLAY-NON-MOUNT]
R31  4.7K  [R1206]
R32  4.7K  [R1206]
R33  4.7K  [R1206]
R34  10K  [R0402]
R35  10K  [R0402]
R36  10K  [R0402]
R38  10K  [R0402]
R39  10K  [R0402]
R40  10K  [R0402]
R41  10K  [R0402]
SW1  RESET  [SW-SMD_4P-L4.2-W3.2-P2.15-LS4.5]
U5  MAX3485ESA+T  [SOIC-8_L4.9-W3.9-P1.27-LS6.0-BL]
U6  MPU-6050_C24112  [QFN-24_L4.0-W4.0-P0.50-BL-EP2.7]
U7  CAT24C512WI-GT3  [SOIC-8_L4.9-W3.9-P1.27-LS6.0-BL]
U11  W5100S-EVB-PICO  [WIZNET W5100S-EVB-PICO-DEBUG-PINS-HOLE]
sheet DV_MR_rev_18.16_modbus_ADC_POWER
C8  1uF  [C0603]
C21  470uF  [CAP-SMD_BD10.0-L10.3-W10.3-FD]
C22  100uF  [C1206]
C23  100uF  [C1210]
C27  10uF  [CAP-SMD_L3.2-W1.6-R-RD]
C28  100nF  [C0402_NEW]
C48  100uF  [C1206]
C49  100nF  [C0402_NEW]
C50  10uF  [CAP-SMD_L3.2-W1.6-R-RD]
C67  1uF  [C0603]
C68  470uF  [CAP-SMD_BD10.0-L10.3-W10.3-FD]
C69  100uF  [C1210]
D25  1N5819WS  [SOD-323_L1.8-W1.3-LS2.5-RD]
D32  1N5819WS  [SOD-323_L1.8-W1.3-LS2.5-RD]
L2  100uH  [IND-SMD_L13.8-W12.6_SMMS1360]
L3  100uH  [IND-SMD_L13.8-W12.6_SMMS1360]
R68  100K  [R0603]
R142  100K  [R0603]
U9  LM2576HVS-3.3  [PG-TO-263-5_L10.2-W8.7-P1.70-LS14.4-BR]
U10  XL1509-5.0E1  [SOIC-8_L5.0-W4.0-P1.27-LS6.0-BL]

## Library data of the parts
C8 C18 C37 C43 C47 C67 = CL10A105KB8NNNC: Supplier: LCSC; Manufacturer: SAMSUNG; Supplier Part: C15849; JLCPCB Part Class: Basic Part
C4-C7 C9-C11 C13 C14 C16 C19 C24 C25 C28-C33 C36 C38-C40 C42 C45 C46 C51 C63 C64 = CL05B104KO5NNNC: Supplier: LCSC; Manufacturer: SAMSUNG; Supplier Part: C1525; JLCPCB Part Class: Basic Part
C15 C26 C52 C60-C62 C128-C130 C142 C143 C151 C152 = 0603B103K500NT: Supplier: LCSC; Manufacturer: FH; LCSC Assembly: Yes; Supplier Part: C57112; SMT Type: Basic
C12 C34 C56 C57 C65 C140 C141 = 0402B102K500NT: Supplier: LCSC; Manufacturer: FH; LCSC Assembly: Yes; Supplier Part: C1523; SMT Type: Basic
CN8 CN11 CN13-CN18 CN21-CN24 = 15EDGVM-3.81-02P-14-00A(H): Supplier: LCSC; Supplier Part: C507020; Manufacturer: DEGSON; Contributor: LCSC; JLCPCB Part Class: Extended Part
D1-D7 D9 D10 D13-D15 D17 D19 D20 D26-D31 = SM4007PL: Supplier: LCSC; Manufacturer: MDD; image: //image.lceda.cn/szlcsc/C64898.jpg; Supplier Part: C64898; LCSC Assembly: Yes; SMT Type: Basic
LED1-LED6 LED13 = KT-0603R: Supplier: LCSC; Manufacturer: KENTO; Supplier Part: C2286; JLCPCB Part Class: Basic Part
P1-P9 = GND Screw Pad: Contributor: marlon.otto9
Q1 Q3 Q4 Q12-Q14 = MJD122T4G: Supplier: LCSC; Manufacturer: ON; image: //image.lceda.cn/szlcsc/C12789.jpg; Supplier Part: C12789; LCSC Assembly: Yes; SMT Type: Extend
Q2 Q6 Q8 Q18 Q21 = S8050_C2146: Supplier: LCSC; Manufacturer: CJ; Manufacturer Part: S8050; Supplier Part: C2146; JLCPCB Part Class: Basic Part
Q5 Q10 = MMBT5551_C2145: Supplier: LCSC; Manufacturer: CJ; Manufacturer Part: MMBT5551; Supplier Part: C2145; JLCPCB Part Class: Basic Part
Q9 Q11 = AO3401A: Supplier: LCSC; Manufacturer: AOS; Supplier Part: C15127; JLCPCB Part Class: Basic Part
R1 R6 R46-R48 R56 R61 R62 R65 R67 R76 R151 R362 = 1206W4F2401T5E: Supplier: LCSC; Manufacturer: UniOhm; Supplier Part: C17949; LCSC Assembly: Yes; SMT Type: Extend
R4 R7 R20 R52 R53 R57 R60 R64 R66 R84 R99 R110 R111 R114 R117 R118 R153 R353-R356 = 0603WAF1002T5E: Supplier: LCSC; Manufacturer: UniOhm; LCSC Assembly: Yes; Supplier Part: C25804; SMT Type: Basic
R5 R59 R63 R70 R83 R145 R154 R337 R338 = 0603WAF2201T5E: Supplier: LCSC; Manufacturer: UniOhm; LCSC Assembly: Yes; Supplier Part: C4190; SMT Type: Basic
R10 R15 R50 R55 = 0603WAF100JT5E: Supplier: LCSC; Manufacturer: UniOhm; Supplier Part: C22859; JLCPCB Part Class: Basic Part
R37 R49 R51 R54 = RN731JTTD1001F25: Supplier: LCSC; Supplier Part: C719293; Manufacturer: KOA Speer Elec; Contributor: LCSC
R43 R93 R94 = 0603WAF2203T5E: Supplier: LCSC; Manufacturer: UniOhm; Supplier Part: C22961; JLCPCB Part Class: Basic Part
R31-R33 R58 R340 R341 = 1206W4F4701T5E: Supplier: LCSC; Manufacturer: UniOhm; LCSC Assembly: Yes; Supplier Part: C17936; SMT Type: Basic
R345 R346 = 0805W8F4702T5E: Supplier: LCSC; Manufacturer: UniOhm; LCSC Assembly: Yes; Supplier Part: C17713; SMT Type: Basic
R348 R349 = 0603WAF4302T5E: Supplier: LCSC; Manufacturer: UniOhm; LCSC Assembly: Yes; Supplier Part: C23172; SMT Type: Basic
R357 R358 = 0603WAF1502T5E: Supplier: LCSC; Manufacturer: UniOhm; LCSC Assembly: Yes; Supplier Part: C22809; SMT Type: Basic
R359 R360 = 0805W8F4700T5E: Supplier: LCSC; Manufacturer: UniOhm; LCSC Assembly: Yes; Supplier Part: C17710; SMT Type: Basic
U51 U58 U59 = NE555DR: Supplier: LCSC; Manufacturer: TI; LCSC Assembly: Yes; image: //image.lceda.cn/szlcsc/C7593.jpg; Supplier Part: C7593; SMT Type: Basic
C1 C139 = CL10A105KB8NNNC: Supplier: LCSC; Manufacturer: SAMSUNG; LCSC Assembly: Yes; Supplier Part: C15849; SMT Type: Basic
CN1 CN2 = WJ15EDGVM-3.81-04P-14-00A: Supplier: LCSC; Manufacturer: ReliaPro; Contributor: LCSC; Supplier Part: C157478; JLCPCB Part Class: Extended Part
CN3-CN7 CN12 = A2008WV-S-2P: Supplier: LCSC; Supplier Part: C273123; Manufacturer: Changjiang Connectors; Contributor: LCSC; JLCPCB Part Class: Extended Part
D16 D18 D24 D25 D32 = 1N5819WS: Supplier: LCSC; Supplier Part: C191023; Manufacturer: Guangdong Hottech; Contributor: LCSC; JLCPCB Part Class: Extended Part
LED8-LED12 = whiteLEDSMD: Supplier: LCSC; Manufacturer: KENTO; Supplier Part: C34499; JLCPCB Part Class: Basic Part
LED7 LED15 LED17 = 0603White light_C2290: Supplier: LCSC; Manufacturer: KENTO; Manufacturer Part: 0603White light; Supplier Part: C2290; JLCPCB Part Class: Basic Part
Q15 Q17 Q22 = MMBT2222A_C8512: Supplier: LCSC; Manufacturer: CJ; Manufacturer Part: MMBT2222A; Supplier Part: C8512; JLCPCB Part Class: Extended Part
R12 R44 R81 = 0603WAF1501T5E: Supplier: LCSC; Manufacturer: UniOhm; Supplier Part: C22843; JLCPCB Part Class: Basic Part
R42 = 0603WAF1200T5E: Supplier: LCSC; Manufacturer: UniOhm; Supplier Part: C22787; JLCPCB Part Class: Basic Part
R75 R296 = 0402WGF2200TCE: Supplier: LCSC; Manufacturer: UniOhm; Supplier Part: C25091; JLCPCB Part Class: Basic Part
R298 = 0402WGF6800TCE: Supplier: LCSC; Manufacturer: UniOhm; Supplier Part: C25130; JLCPCB Part Class: Basic Part
SJ1 SJ3-SJ6 SJ12-SJ15 = JUMPER-PAD-2-NOYES_SILK: Contributor: SparkFun
U3 U4 = WJ15EDGVM-3.81-3P-14-00A: Supplier: LCSC; Supplier Part: C106870; Manufacturer: Ningbo Kangnex Elec; Contributor: LCSC; JLCPCB Part Class: Extended Part
R2 R3 R8 R9 R13 R14 R18 R19 R23 R24 R28 R29 = 0402WGF100JTCE: Supplier: LCSC; Manufacturer: UniOhm; Supplier Part: C25077; JLCPCB Part Class: Basic Part
R16 R17 R21 R22 R26 R27 = RT1206BRD071RL: Supplier: LCSC; Supplier Part: C513714; Manufacturer: YAGEO; Contributor: LCSC; JLCPCB Part Class: Extended Part
U1 U2 = INA3221AIRGVR: Supplier: LCSC; Supplier Part: C181255; Manufacturer: Texas Instruments; Contributor: LCSC; JLCPCB Part Class: Extended Part
C35 C55 = PE224J2A0501: Supplier: LCSC; Supplier Part: C393118; Manufacturer: KYET; Contributor: LCSC
C53 C54 C58 C59 = 0603B471K500NT: Supplier: LCSC; Manufacturer: FH; LCSC Assembly: Yes; Supplier Part: C1620; SMT Type: Basic
Q19 Q20 = AO3401A: Supplier: LCSC; Manufacturer: AOS; LCSC Assembly: Yes; image: //image.lceda.cn/szlcsc/C15127.jpg; Supplier Part: C15127; SMT Type: Basic
R11 R34-R36 R38-R41 R45 R71 R72 R74 R78 R82 R87-R91 = 0402WGF1002TCE: Supplier: LCSC; Manufacturer: UniOhm; Supplier Part: C25744; JLCPCB Part Class: Basic Part
R25 R30 R85 R135 = 0402WGF3300TCE: Supplier: LCSC; Manufacturer: UniOhm; Supplier Part: C25104; JLCPCB Part Class: Basic Part
R69 R73 R77 R115 R133 R134 = 0402WGF1001TCE: Supplier: LCSC; Manufacturer: UniOhm; Supplier Part: C11702; JLCPCB Part Class: Basic Part
R79 R86 R92 = 0402WGF1500TCE: Supplier: LCSC; Manufacturer: UniOhm; Supplier Part: C25082; JLCPCB Part Class: Basic Part
R80 = 0603WAF3300T5E: Supplier: LCSC; Manufacturer: UniOhm; Supplier Part: C23138; JLCPCB Part Class: Basic Part
R95 R122 = 0603WAF1005T5E: Supplier: LCSC; Manufacturer: UniOhm; LCSC Assembly: Yes; Supplier Part: C7250; SMT Type: Basic
R96 R106 R107 R121 R125 R126 = 0402WGF2202TCE: Supplier: LCSC; Manufacturer: UniOhm; LCSC Assembly: Yes; Supplier Part: C25768; SMT Type: Basic
R97 R103 R120 R129 = 0402WGF1002TCE: Supplier: LCSC; Manufacturer: UniOhm; LCSC Assembly: Yes; Supplier Part: C25744; SMT Type: Basic
R100 R132 = 0603WAF2203T5E: Supplier: LCSC; Manufacturer: UniOhm; LCSC Assembly: Yes; Supplier Part: C22961; SMT Type: Basic
R101 R131 = 0805W8F1204T5E: Supplier: LCSC; Manufacturer: UniOhm; LCSC Assembly: Yes; Supplier Part: C17380; SMT Type: Basic
R102 R108 R109 R119 R124 R130 = 0603WAF1003T5E: Supplier: LCSC; Manufacturer: UniOhm; LCSC Assembly: Yes; Supplier Part: C25803; SMT Type: Basic
R104 R128 = 0603WAF6801T5E: Supplier: LCSC; Manufacturer: UniOhm; LCSC Assembly: Yes; Supplier Part: C23212; SMT Type: Basic
R105 R127 = 0603WAF1000T5E: Supplier: LCSC; Manufacturer: UniOhm; LCSC Assembly: Yes; Supplier Part: C22775; SMT Type: Basic
R112 R123 = 0603WAF470JT5E: Supplier: LCSC; Manufacturer: UniOhm; LCSC Assembly: Yes; Supplier Part: C23182; SMT Type: Basic
R113 R116 = 0805W8F1500T5E: Supplier: LCSC; Manufacturer: UniOhm; LCSC Assembly: Yes; Supplier Part: C17471; SMT Type: Basic
SJ2 SJ17 = JUMPER-PAD-2-NC_BY_TRACE: Contributor: SparkFun
U13 U14 U16 U17 = MCP6002T-I/SN: Supplier: LCSC; Manufacturer: MICROCHIP; LCSC Assembly: Yes; image: //image.lceda.cn/szlcsc/C7377.jpg; Supplier Part: C7377; SMT Type: Basic
U15 U18 = LM358DR2G: Supplier: LCSC; Manufacturer: ON; LCSC Assembly: Yes; image: //image.lceda.cn/szlcsc/C7950.jpg; Supplier Part: C7950; SMT Type: Basic
C2 = 0402B222K500NT: Supplier: LCSC; Manufacturer: FH; Supplier Part: C1531; JLCPCB Part Class: Basic Part
D23 = SS34_C8678: Supplier: LCSC; Manufacturer Part: SS34; Manufacturer: MDD; Supplier Part: C8678; JLCPCB Part Class: Basic Part
H1 = 8DIGIT7SEGMENTDISPLAY-NON_MOUNT: Contributor: BauerTechnology
SW1 = GT-TC048A-H025-L1: Supplier: LCSC; Supplier Part: C778166; Manufacturer: G-Switch; Contributor: LCSC; JLCPCB Part Class: Extended Part
U5 = MAX3485ESA+T: Supplier: LCSC; Manufacturer: MAXIM; Supplier Part: C18148; JLCPCB Part Class: Extended Part
U6 = MPU-6050_C24112: sourceId: 1T5FDZYC8; Supplier: LCSC; Manufacturer: InvenSense; Manufacturer Part: MPU-6050; Supplier Part: C24112; JLCPCB Part Class: Basic Part
U7 = CAT24C512WI-GT3: Supplier: LCSC; Manufacturer: ON; Supplier Part: C79986; JLCPCB Part Class: Extended Part
U11 = W5100S-EVB-PICO COPY: Manufacturer: Wiznet; Manufacturer Part: W5100S-EVB-Pico; Supplier Part: 950-W5100S-EVB-PICO; Supplier: Mouser; link: https://no.mouser.com/ProductDetail/WIZnet/W5100S-EVB-Pico?qs=XAiT9M5g4x8nVfIkhUijRw%3D%3D; Contributor: Jostein Løwer
C21 C68 = RVT1V471M1010: Supplier: LCSC; Manufacturer: HONOR; Supplier Part: C3350; JLCPCB Part Class: Extended Part
C22 C48 = CL31A107MQHNNNE: Supplier: LCSC; Manufacturer: SAMSUNG; Supplier Part: C15008; JLCPCB Part Class: Extended Part
C23 C69 = EMK325ABJ107MM-P: Supplier: LCSC; Supplier Part: C90143; Manufacturer: Taiyo Yuden; Contributor: LCSC; JLCPCB Part Class: Extended Part
C27 C50 = CA45-A-16V-10UF-K: Supplier: LCSC; Manufacturer: CEC; Manufacturer Part: CA45-A-16V-10uF-K; Contributor: LCSC; Supplier Part: C128254; JLCPCB Part Class: Extended Part
C49 = CL05B104KO5NNNC: Supplier: LCSC; Manufacturer: SAMSUNG; Supplier Part: C1525; JLCPCB Part Class: Basic Part; Package Display: No
L2 L3 = SMMS1360-101M: Supplier: LCSC; Manufacturer: SXN; Supplier Part: C149534; JLCPCB Part Class: Extended Part; Package Display: No
R68 R142 = 0603WAF1003T5E: Supplier: LCSC; Manufacturer: UniOhm; Supplier Part: C25803; JLCPCB Part Class: Basic Part
U9 = LM2576HVS-3.3: Supplier: LCSC; Supplier Part: C347436; Manufacturer: UMW(友台半导体); Contributor: LCSC; JLCPCB Part Class: Extended Part
U10 = XL1509-5.0E1: Supplier: LCSC; Manufacturer: XLSEMI; Supplier Part: C61063; JLCPCB Part Class: Basic Part

## Nets
3.3V_out: D32.1(C) L3.1 U9.2(Output)
3V3: C9.2 C14.2 C15.2 C23.2 C24.2 C25.2 C49.1 C50.1 C67.2 C68.1 D16.1(C) L3.2 R7.1 R30.1 R34.1 R35.2 R36.2 R38.2 R68.2 R85.2 U1.4(VS) U1.16(VPU) U2.4(VS) U2.5(A0) U2.16(VPU) U5.8(VCC) U6.13(VDD) U9.4(Feedback)
3V3_PI: C13.1 D16.2(A) R31.2 R32.2 R33.2 U7.8(VCC) U11.36(3V3_OUT)
5V0: C8.2 C21.1 C27.1 C28.1 C33.1 C63.2 C64.2 C69.2 D23.2(A) D24.1(C) H1.1(VCC) L2.2 Q9.2(S) Q13.2(C) Q14.2(C) R58.2 R101.1 R131.1 R142.2 R348.2 R349.2 U10.3(FB) U13.8(VDD) U14.8(VDD) U16.8(VDD) U17.8(VDD) U58.8(VCC) U59.8(VCC)
GND: C1.1 C2.2 C8.1 C9.1 C10.1 C13.2 C14.1 C15.1 C19.1 C21.2 C22.1 C23.1 C24.1 C25.1 C26.1 C27.2 C28.2 C29.1 C30.1 C31.1 C32.2 C33.2 C34.1 C35.1 C36.1 C38.1 C39.1 C40.1 C42.1 C45.1 C46.1 C48.1 C49.2 C50.2 C51.1 C52.1 C55.1 C56.1 C60.1 C61.1 C62.1 C63.1 C64.1 C65.1 C67.1 C68.2 C69.1 C128.2 C130.2 C139.1 C140.1 C141.1 C142.2 C143.2 C151.1 C152.1 CN1.4 CN3.2 CN4.2 CN5.2 CN21.1 CN23.1 D5.2(A) D6.2(A) D7.2(A) D9.2(A) D15.2(A) D17.2(A) D18.2(A) D20.2(A) D25.2(A) D26.2(A) D27.2(A) D28.2(A) D29.2(A) D30.2(A) D32.2(A) H1.2(GND) LED8.2(K) LED9.2(K) LED10.2(K) LED11.2(K) LED12.2(K) LED17.2(K) P1.GND1(GND) P2.GND1(GND) P3.GND1(GND) P4.GND1(GND) P5.GND1(GND) P6.GND1(GND) P7.GND1(GND) P8.GND1(GND) P9.GND1(GND) Q1.3(E) Q2.2(E) Q3.3(E) Q4.3(E) Q5.2(E) Q6.2(E) Q8.2(E) Q10.2(E) Q12.3(E) Q15.2(E) Q17.2(E) Q18.2(E) Q21.2(E) Q22.2(E) R4.2 R20.1 R40.1 R43.1 R45.1 R52.1 R53.1 R57.1 R60.1 R64.1 R66.1 R68.1 R72.1 R74.1 R78.1 R80.1 R82.1 R84.1 R87.1 R89.2 R90.2 R93.1 R94.1 R95.1 R99.2 R102.2 R104.1 R114.1 R122.1 R128.1 R130.2 R135.1 R142.1 R345.2 R346.2 R353.1 R354.1 R355.1 R356.1 R359.2 R360.2 SJ12.1 SJ13.1 SJ14.1 SJ15.1 SW1.4 U1.3(GND) U1.5(A0) U2.3(GND) U3.3 U4.3 U5.5(GND) U6.1(CLKIN) U6.9(AD0) U6.11(FSYNC) U6.18(GND) U6.25(GND) U7.1(A0) U7.2(A1) U7.3(A2) U7.4(VSS) U9.3(Gnd) U9.5(ON#/OFF) U9.6(TAB) U10.4(ON/OFF) U10.5(GND) U10.6(GND) U10.7(GND) U10.8(GND) U11.3(GND) U11.8(GND) U11.13(GND) U11.18(GND) U11.23(GND) U11.28(GND) U11.33(GND) U11.38(GND) U13.4(-VSS) U14.4(-VSS) U15.4(GND) U16.4(-VSS) U17.4(-VSS) U18.4(GND) U51.1(GND) U58.1(GND) U59.1(GND)
VBUS: C32.1 D24.2(A) U11.40(VBUS)
4-20MA_NEG_1: CN2.1 R13.1 R21.2 SJ15.2
4-20MA_NEG_2: CN2.2 R18.1 R27.1 SJ14.2
4-20MA_NEG_3: CN2.3 R23.1 R26.1 SJ13.2
4-20MA_NEG_4: CN2.4 R22.2 R28.1 SJ12.2
4-20MA_NEG_10: CN11.1 R14.1 R21.1
4-20MA_NEG_20: CN13.1 R19.1 R27.2
4-20MA_NEG_30: CN17.1 R24.1 R26.2
4-20MA_NEG_40: CN24.1 R22.1 R29.1
C0-0: C139.2 CN1.2 D26.1(C) D27.1(C) R44.1 R73.2 R133.1 R298.2 U3.1 U4.1
C0-1: C141.2 D30.1(C) Q14.3(E) R75.2 R355.2 U3.2
C1-1: C140.2 D29.1(C) Q13.3(E) R296.2 R353.2 U4.2
GP0: R37.1 U11.1(GP0)
GP1: R49.1 U11.2(GP1)
GP2: R51.1 U11.4(GP2)
GP3: R54.1 U11.5(GP3)
GP4: R35.1 U5.4(DI) U11.6(GP4)
GP5: R38.1 U5.1(RO) U11.7(GP5)
GP6: R145.1 U11.9(GP6)
GP7: R70.1 U11.10(GP7)
GP14: R36.1 U5.2(RE#) U5.3(DE) U11.19(GP14)
GP15: R154.1 U11.20(GP15)
GP22: R83.1 U11.29(GP22)
GP26: R59.1 U11.31(GP26)
GP27: R63.1 U11.32(GP27)
GP28: Q2.3(C) R7.2 U11.34(GP28)
MA0+: CN18.1 R2.1 R17.2
MA00+: R3.1 R17.1 R123.2
MA01+: R8.1 R16.2 R112.2
MA1+: CN18.2 R9.1 R16.1
P0-0: C19.2 C22.2 C36.2 C39.2 C46.2 C48.2 CN1.1 CN11.2 CN13.2 CN14.2 CN15.2 CN16.2 CN17.2 CN22.2 CN24.2 D13.1(C) D14.1(C) D19.1(C) D31.1(C) Q11.2(S) R1.1 R6.2 R10.2 R11.1 R12.1 R15.2 R46.1 R47.1 R48.1 R50.2 R55.2 R56.2 R61.1 R62.2 R65.1 R67.1 R91.1 R153.1 R362.2 U9.1(Vin) U10.1(VIN) U15.8(VCC) U18.8(VCC)
P0-2: C1.2 CN1.3 D10.1(C) D17.1(C) D18.1(C) Q5.1(B) R71.1 R76.2 R81.1 R88.2 R341.2 R346.1
PICORUN: SW1.2 U11.30(RUN)
RST0: C55.2 Q20.2(S) R116.2 R122.2 U16.3(+INA)
RST1: C35.2 Q19.2(S) R95.2 R113.2 U14.3(+INA)
RTU_A: CN8.2 R41.2 R42.2 U5.6(A)
RTU_B: CN8.1 R39.2 SJ1.1 U5.7(B)
SCL: R31.1 U1.6(SCL) U2.6(SCL) U6.23(SCL) U7.6(SCL) U11.12(GP9)
SDA: R32.1 U1.7(SDA) U2.7(SDA) U6.24(SDA) U7.5(SDA) U11.11(GP8)
SLV01_GND: C37.1 C38.2 CN22.1 D19.2(A) LED5.2(K) Q4.2(C)
SLV02_GND: C18.1 C40.2 CN14.1 D13.2(A) LED6.2(K) Q1.2(C)
SLV03_GND: C42.2 C43.1 CN15.1 D14.2(A) LED2.2(K) Q3.2(C)
SLV04_GND: C45.2 C47.1 CN16.1 D31.2(A) LED13.2(K) Q12.2(C)
SNS0: C57.1 CN23.2
SNS1: C12.1 CN21.2
SPI 1 CSn: H1.4(CS) U11.17(GP13)
SPI 1 SCK: H1.5(CLK) U11.14(GP10)
SPI 1 TX: H1.3(DIN) U11.15(GP11)
Net-(C2-1): C2.1 U6.20(CPOUT)
Net-(C4-1): C4.1 R8.2 U1.14(IN-2)
Net-(C4-2): C4.2 R9.2 U1.15(IN+2)
Net-(C5-1): C5.1 R13.2 U1.1(IN-3)
Net-(C5-2): C5.2 R14.2 U1.2(IN+3)
Net-(C6-1): C6.1 R23.2 U2.11(IN-1)
Net-(C6-2): C6.2 R24.2 U2.12(IN+1)
Net-(C7-1): C7.1 R18.2 U2.14(IN-2)
Net-(C7-2): C7.2 R19.2 U2.15(IN+2)
Net-(C10-2): C10.2 U6.10(REGOUT)
Net-(C11-1): C11.1 R28.2 U2.1(IN-3)
Net-(C11-2): C11.2 R29.2 U2.2(IN+3)
Net-(C12-2): C12.2 R110.2
Net-(C16-1): C16.1 R3.2 U1.11(IN-1)
Net-(C16-2): C16.2 R2.2 U1.12(IN+1)
Net-(C18-2): C18.2 R15.1
Net-(C26-2): C26.2 U6.8(VLOGIC)
Net-(C29-2): C29.2 R358.1 U58.2(TRIG) U58.6(THRES)
Net-(C30-2): C30.2 R357.1 U59.2(TRIG) U59.6(THRES)
Net-(C31-2): C31.2 D23.1(K) U11.39(VSYS)
Net-(C34-2): C34.2 R111.2
Net-(C37-2): C37.2 R10.1
Net-(C43-2): C43.2 R50.1
Net-(C47-2): C47.2 R55.1
Net-(C51-2): C51.2 C129.2 Q9.3(D) R5.1 R57.2 U51.4(RST) U51.8(VCC)
Net-(C52-2): C52.2 R100.2 R101.2 U15.3(1IN+)
Net-(C53-1): C53.1 R105.2 R106.2 U15.1(1OUT)
Net-(C53-2): C53.2 R103.1 R104.2 U15.2(1IN-)
Net-(C54-1): C54.1 R107.1 R108.2 U15.6(2IN-)
Net-(C54-2): C54.2 R103.2 R108.1 U15.7(2OUT)
Net-(C56-2): C56.2 R117.2
Net-(C57-2): C57.2 R118.2
Net-(C58-1): C58.1 R124.2 R125.1 U18.6(2IN-)
Net-(C58-2): C58.2 R124.1 R129.2 U18.7(2OUT)
Net-(C59-1): C59.1 R126.2 R127.2 U18.1(1OUT)
Net-(C59-2): C59.2 R128.2 R129.1 U18.2(1IN-)
Net-(C60-2): C60.2 R131.2 R132.2 U18.3(1IN+)
Net-(C61-2): C61.2 D5.1(C) R77.1 R79.1 R82.2
Net-(C62-2): C62.2 D6.1(C) R78.2 R86.1 R134.1
Net-(C65-2): C65.2 D9.1(C) D10.2(A) Q11.3(D) R114.2 R151.1
Net-(C128-1): C128.1 U51.7(DISCH)
Net-(C129-1): C129.1 R43.2 U51.2(TRIG) U51.6(THRES)
Net-(C130-1): C130.1 U51.5(COUT)
Net-(C142-1): C142.1 R340.1 R359.1 U58.4(RST)
Net-(C143-1): C143.1 R341.1 R360.1 U59.4(RST)
Net-(C151-2): C151.2 U58.5(COUT)
Net-(C152-2): C152.2 U59.5(COUT)
Net-(CN3-1): CN3.1 R12.2
Net-(CN4-1): CN4.1 R44.2
Net-(CN5-1): CN5.1 R81.2
Net-(CN6-1): CN6.1 R62.1
Net-(CN6-2): CN6.2 LED4.2(K) Q17.3(C)
Net-(CN7-1): CN7.1 R56.1
Net-(CN7-2): CN7.2 LED1.2(K) Q15.3(C)
Net-(CN12-1): CN12.1 R6.1
Net-(CN12-2): CN12.2 LED3.2(K) Q22.3(C)
Net-(D1-1): D1.1(C) D2.2(A) R96.1
Net-(D1-2): D1.2(A) U13.7(OUTB)
Net-(D2-1): D2.1(C) R113.1 U13.6(-INB)
Net-(D3-1): D3.1(C) R116.1 U17.6(-INB)
Net-(D3-2): D3.2(A) D4.1(C) R121.1
Net-(D4-2): D4.2(A) U17.7(OUTB)
Net-(D7-1): D7.1(C) Q4.1(B) R37.2 R52.2
Net-(D15-1): D15.1(C) Q12.1(B) R20.2 R54.2
Net-(D20-1): D20.1(C) Q1.1(B) R49.2 R66.2
Net-(D25-1): D25.1(C) L2.1 U10.2(OUTPUT)
Net-(D28-1): D28.1(C) Q3.1(B) R51.2 R53.2
Net-(LED1-1): LED1.1(A) R47.2
Net-(LED2-1): LED2.1(A) R48.2
Net-(LED3-1): LED3.1(A) R46.2
Net-(LED4-1): LED4.1(A) R61.2
Net-(LED5-1): LED5.1(A) R65.2
Net-(LED6-1): LED6.1(A) R1.2
Net-(LED7-1): LED7.1(A) R85.1
Net-(LED7-2): LED7.2(K) Q6.3(C)
Net-(LED8-1): LED8.1(A) R296.1
Net-(LED9-1): LED9.1(A) R75.1
Net-(LED10-1): LED10.1(A) R298.1
Net-(LED11-1): LED11.1(A) R76.1
Net-(LED12-1): LED12.1(A) R362.1
Net-(LED13-1): LED13.1(A) R67.2
Net-(LED15-1): LED15.1(A) R30.2
Net-(LED15-2): LED15.2(K) Q8.3(C)
Net-(LED17-1): LED17.1(A) R151.2
Net-(Q2-1): Q2.1(B) R4.1 R5.2
Net-(Q5-3): Q5.3(C) Q9.1(G) R58.1
Net-(Q6-1): Q6.1(B) R25.2
Net-(Q8-1): Q8.1(B) R92.2
Net-(Q10-1): Q10.1(B) R99.1 R154.2
Net-(Q10-3): Q10.3(C) Q11.1(G) R153.2
Net-(Q13-1): Q13.1(B) R337.2
Net-(Q14-1): Q14.1(B) R338.2
Net-(Q15-1): Q15.1(B) R59.2 R60.2
Net-(Q17-1): Q17.1(B) R63.2 R64.2
Net-(Q18-1): Q18.1(B) R70.2 R89.1
Net-(Q18-3): Q18.3(C) R69.1 SJ2.2
Net-(Q19-1): Q19.1(G) R79.2
Net-(Q19-3): Q19.3(D) R25.1 R80.2
Net-(Q20-1): Q20.1(G) R86.2
Net-(Q20-3): Q20.3(D) R92.1 R135.2
Net-(Q21-1): Q21.1(B) R45.2 R145.2
Net-(Q21-3): Q21.3(C) R115.1 SJ17.2
Net-(Q22-1): Q22.1(B) R83.2 R84.2
Net-(R11-2): R11.2 R74.2 R115.2
Net-(R33-1): R33.1 U7.7(WP)
Net-(R34-2): R34.2 R41.1
Net-(R39-1): R39.1 R40.2
Net-(R42-1): R42.1 SJ1.2
Net-(R69-2): R69.2 R90.1 R91.2
Net-(R71-2): R71.2 R72.2 SJ6.1
Net-(R73-1): R73.1 SJ4.1
Net-(R77-2): R77.2 SJ2.1 SJ4.2 SJ5.2
Net-(R87-2): R87.2 R88.1 SJ5.1
Net-(R93-2): R93.2 R110.1 U13.3(+INA)
Net-(R94-2): R94.2 R118.1 U17.3(+INA)
Net-(R96-2): R96.2 R97.1 U14.1(OUTA) U14.2(-INA)
Net-(R97-2): R97.2 U14.5(+INB)
Net-(R100-1): R100.1 U14.6(-INB) U14.7(OUTB)
Net-(R102-1): R102.1 R106.1 U15.5(2IN+)
Net-(R105-1): R105.1 R107.2 R112.1
Net-(R109-1): R109.1 R111.1 U13.2(-INA)
Net-(R109-2): R109.2 U13.1(OUTA) U13.5(+INB)
Net-(R117-1): R117.1 R119.1 U17.2(-INA)
Net-(R119-2): R119.2 U17.1(OUTA) U17.5(+INB)
Net-(R120-1): R120.1 R121.2 U16.1(OUTA) U16.2(-INA)
Net-(R120-2): R120.2 U16.5(+INB)
Net-(R123-1): R123.1 R125.2 R127.1
Net-(R126-1): R126.1 R130.1 U18.5(2IN+)
Net-(R132-1): R132.1 U16.6(-INB) U16.7(OUTB)
Net-(R133-2): R133.2 SJ3.1
Net-(R134-2): R134.2 SJ3.2 SJ6.2 SJ17.1
Net-(R337-1): R337.1 R354.2 U58.3(OUT)
Net-(R338-1): R338.1 R356.2 U59.3(OUT)
Net-(R340-2): R340.2 R345.1 U51.3(OUT)
Net-(R348-1): R348.1 R358.2 U58.7(DISCH)
Net-(R349-1): R349.1 R357.2 U59.7(DISCH)

Not connected (* = marked no-connect by the designer): CN3 0*; CN4 0*; CN5 0*; CN6 0*; CN7 0*; CN12 0*; H1 6(CLK)* 7(LODA)* 8(DOUT)* 9(GND)* 10(VCC)*; SW1 1* 3*; U1 8(WARNING)* 9(CRITICAL)* 10(PV)* 13(TC)* 17(PAD)*; U2 8(WARNING)* 9(CRITICAL)* 10(PV)* 13(TC)* 17(PAD)*; U6 2(NC)* 3(NC)* 4(NC)* 5(NC)* 6(AUX_DA)* 7(AUX_CL)* 12(INT)* 14(NC)* 15(NC)* 16(NC)* 17(NC)* 19(RESV)* 21(RESV)* 22(RESV)*; U11 16(GP12)* 21(GP16/MISO)* 22(GP17/CSn)* 24(GP18/SCLK)* 25(GP19/MOSI)* 26(GP20/RSTn)* 27(GP21/INTn)* 35(VRef)* 37(3V3_En)*

## Notes on the sheets
sheet 1
- 24VDC / 2 Amps / Induductive coil load
- 24VDC / 2 Amps / Induductive coil load
- 24VDC / 2 Amps / Induductive coil load
- 24VDC / 2 Amps / Induductive coil load
- 2.42 ms delay-on to reduce
  inrush on Power Supply to Coils.
- WhatsApp: +1-919-455-4808
- VOLODYNE
sheet 2
- REVIEW ALL ADDRESS FOR I2C BUS
- GYROSCOPE, added to I2C interface
- addr 0x68
- 8-digit seven segment display with max7219
- MODBUS RTU
- Ethernet
- Ethernet
- Ethernet
- Ethernet
- consider Galvanic isolation
  for TX/RX from PICO
  6n137 for pins 1 - 4
- ADDR 0x50
- Ethernet
- 512kb EPROM NON VOLITILE MEMORY
- Ethernet
- MICROCONTROLLER WITH ETHERNET FOR WRITING ANALOG VALUES FROM SENSORS TO REGISTERS.
  POWER SUPPLY USE BUCK CONVERTER TO POWER 3.3V FROM 24V VSS.
  CONSIDER POWERING PICO 5V SUPPLY WITH BUCK CONVERTER
  IF PICO HAS EXPOSED CASTLEATED PINS.
  MODBUS PROTOCOL TCP.
  REFER TO GITHUB FOR MATURE MODBUS TCP LIBARY FOR PICO PI (CPP)
- Ensure no conflicts GP, SPI, I2C
- WhatsApp: +1-919-455-4808
- 18.15
- VOLODYNE
sheet 3
- addr 0x41
- addr 0x40
- WhatsApp: +1-919-455-4808
- VOLODYNE
sheet 4
- P0-2 Protection
- 24V0
- 12V0
- TRIG
- 24VDC /
  20 Milli Amps /
  LED Load
- 24VDC /
  20 Milli Amps /
  LED Load
- 24VDC /
  20 Milli Amps /
  LED Load
- LED P0-0, 24VDC
- LED P0-1, 12VDC
- LED P0-2, 24VDC
- LED PICO GP22,
  3.3VDC GPIO
- LED PICO GP26,
  3.3VDC GPIO
- LED PICO GP27,
  3.3VDC GPIO
- R42 120R
  JUMPER NEEDED
  CUT ON PCB
  TO DISABLE
- 2.7v
- 2.7v
- 2.7v
- 24VDC /
  20 Milli Amps /
  LED Load
- 24VDC /
  20 Milli Amps /
  LED Load
- 24VDC /
  20 Milli Amps /
  LED Load
- WhatsApp: +1-919-455-4808
sheet 5
- WhatsApp: +1-919-455-4808
sheet 6
- Add power to 5V0 and 3V3 from PI PICO for debugging with protection.
- WhatsApp: +1-919-455-4808
